# EAGLE design Angra_v.1.0 (EAGLE 9.4.2)
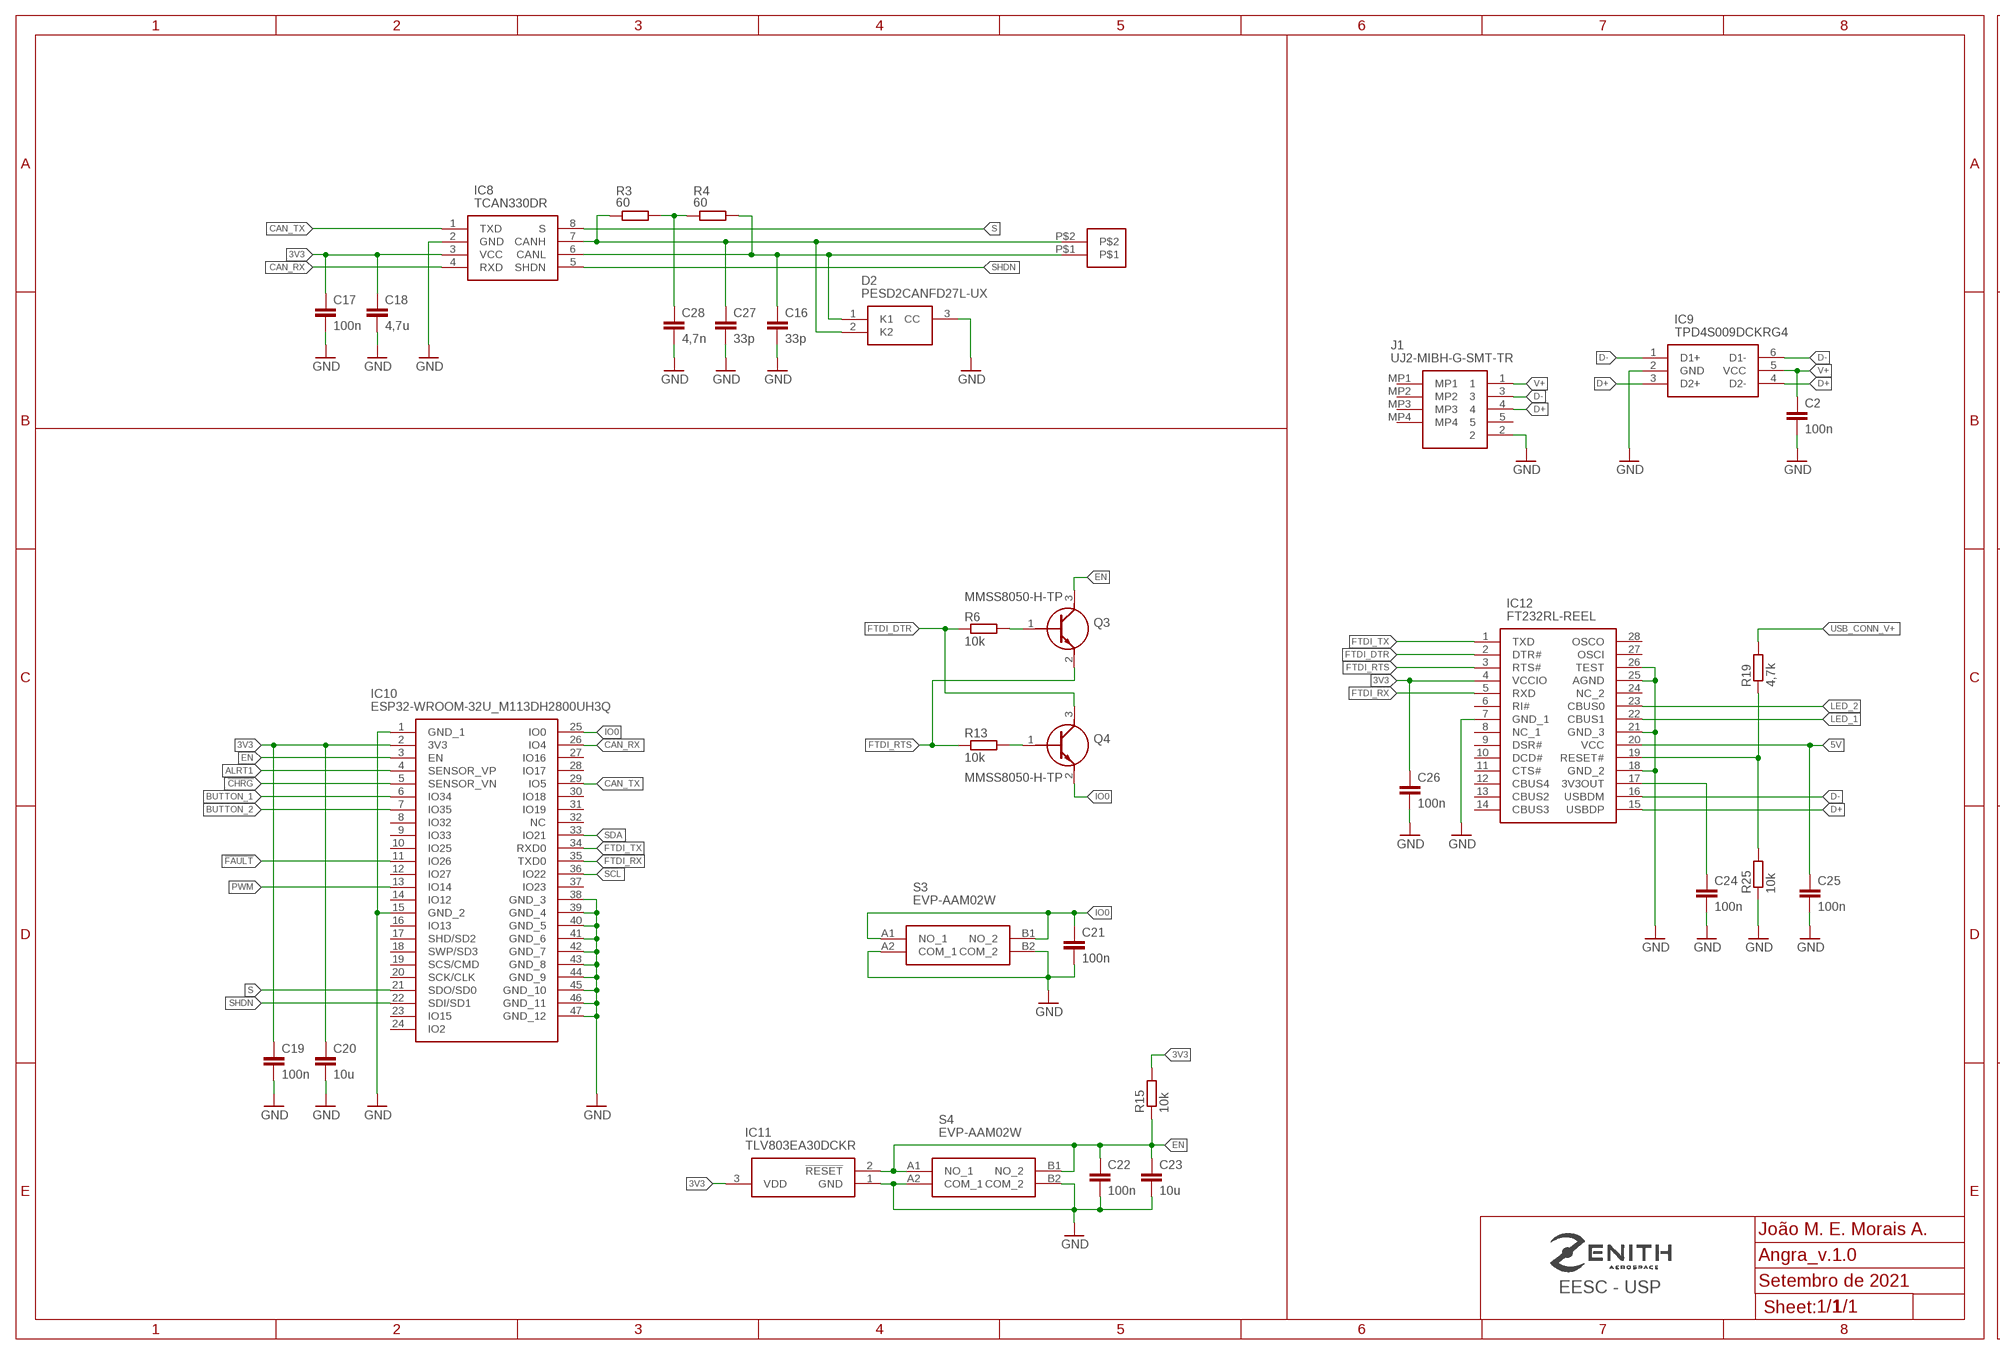
[diagram p0: schematic, sheet 1, part 1 of 2]
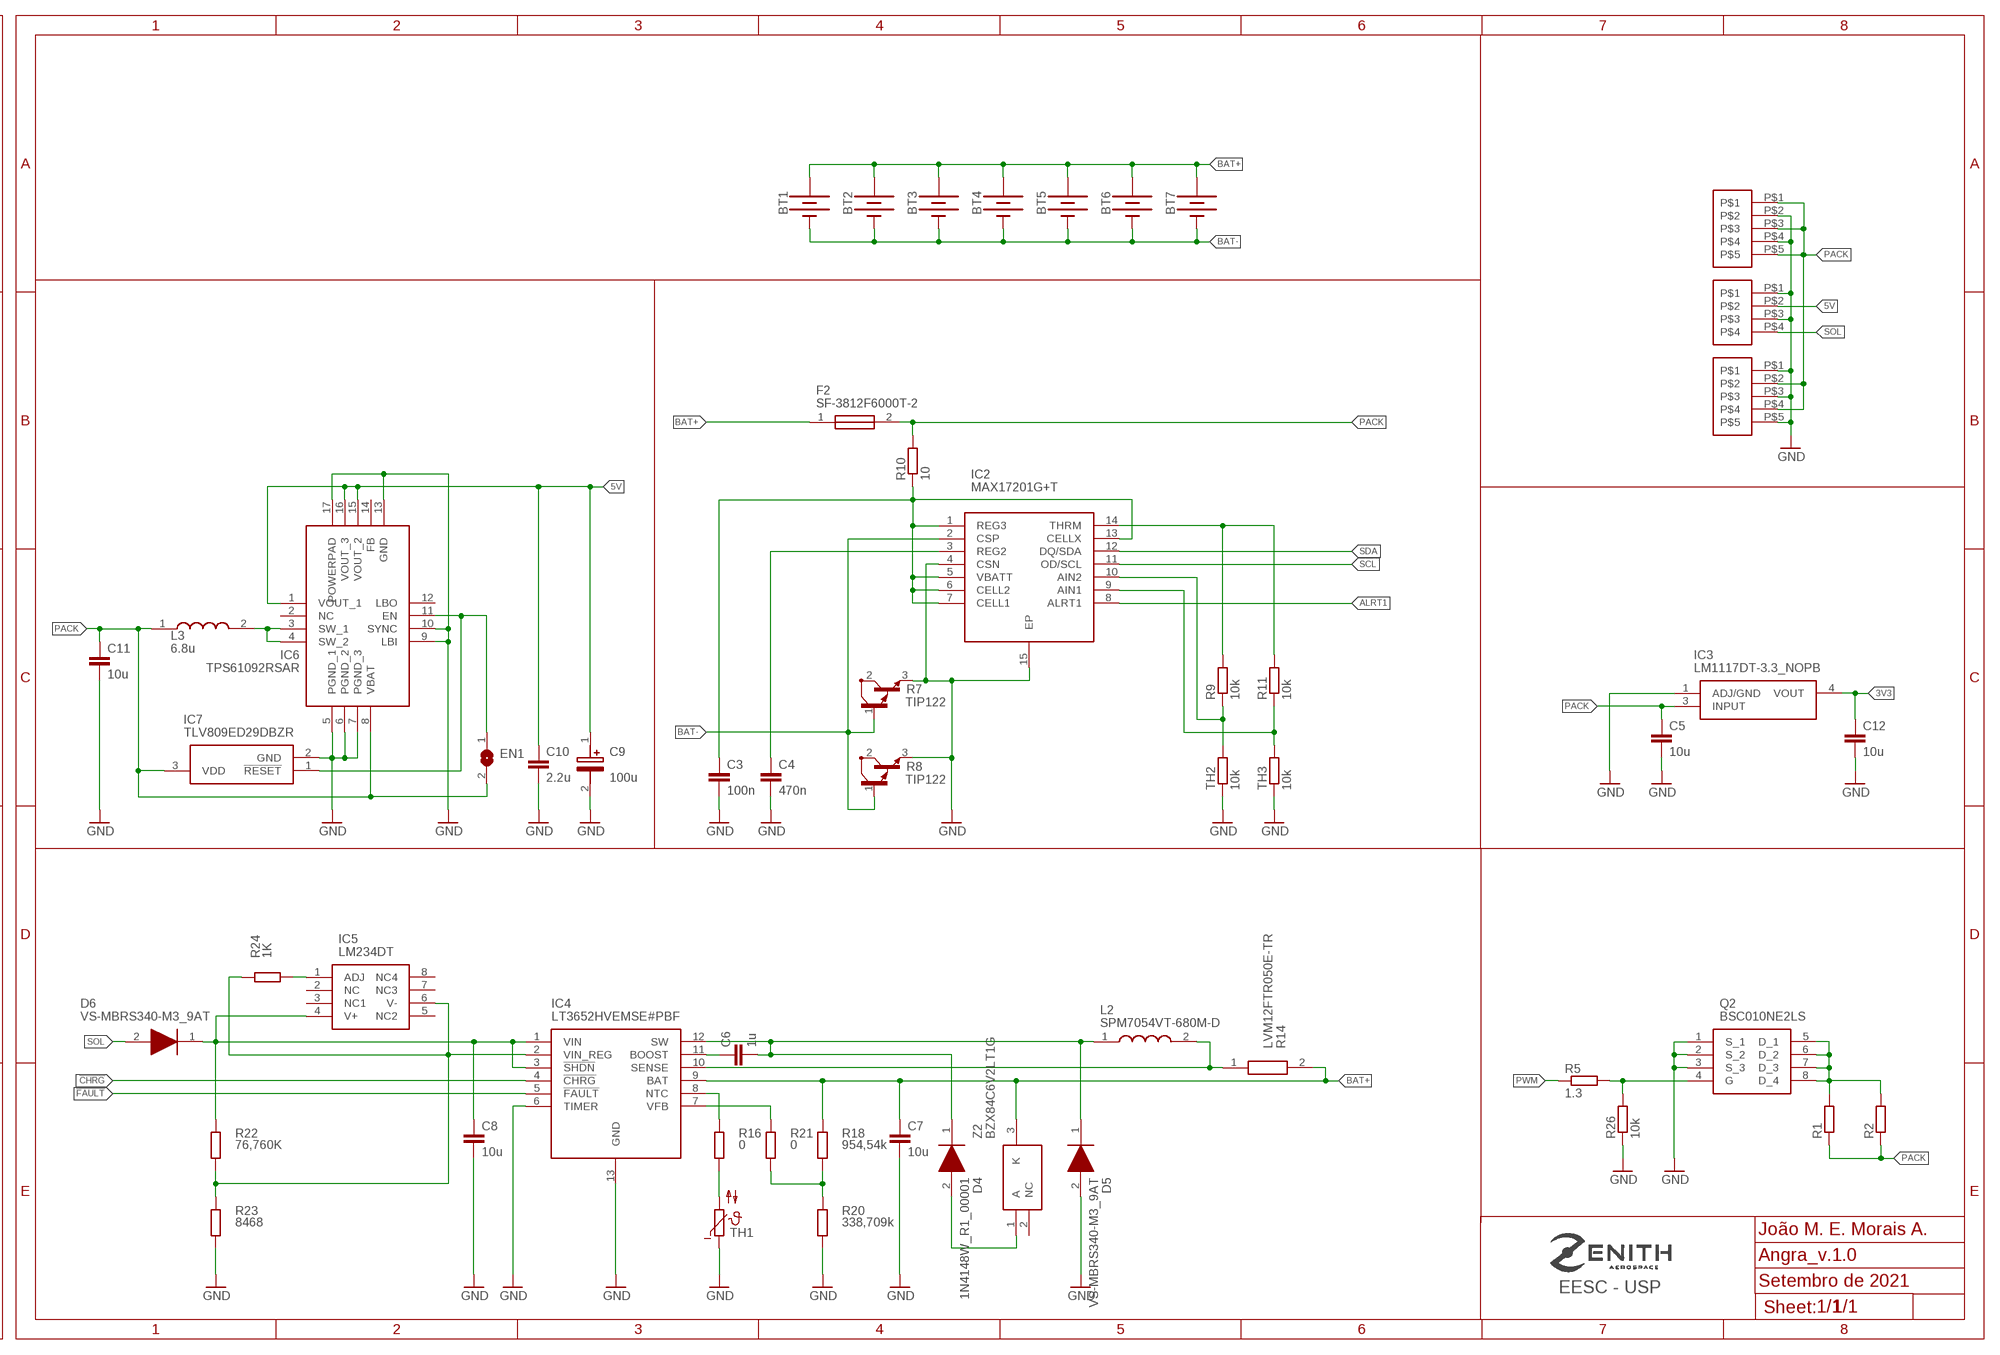
[diagram p1: schematic, sheet 1, part 2 of 2]

## Parts
BT1  BATTERY-18650  [BATTERY_18650-HOLDER]
BT2  BATTERY-18650  [BATTERY_18650-HOLDER]
BT3  BATTERY-18650  [BATTERY_18650-HOLDER]
BT4  BATTERY-18650  [BATTERY_18650-HOLDER]
BT5  BATTERY-18650  [BATTERY_18650-HOLDER]
BT6  BATTERY-18650  [BATTERY_18650-HOLDER]
BT7  BATTERY-18650  [BATTERY_18650-HOLDER]
C2  100n  C-EUC0805  [C0805]
C3  100n  C-EUC0805  [C0805]
C4  470n  C-EUC0805  [C0805]
C5  10u  C-EUC0805  [C0805]
C6  1u  C-EUC0805  [C0805]
C7  10u  C-EUC0805  [C0805]
C8  10u  C-EUC0805  [C0805]
C9  100u  T598B107M004ATE045  [CAPPM3528X210N]
C10  2.2u  C-EUC1206  [C1206]
C11  10u  C-EUC1206  [C1206]
C12  10u  C-EUC0805  [C0805]
C16  33p  C-EUC0805  [C0805]
C17  100n  C-EUC0805  [C0805]
C18  4,7u  C-EUC0805  [C0805]
C19  100n  C-EUC0805  [C0805]
C20  10u  C-EUC0805  [C0805]
C21  100n  C-EUC0805  [C0805]
C22  100n  C-EUC0805  [C0805]
C23  10u  C-EUC0805  [C0805]
C24  100n  C-EUC0805  [C0805]
C25  100n  C-EUC0805  [C0805]
C26  100n  C-EUC0805  [C0805]
C27  33p  C-EUC0805  [C0805]
C28  4,7n  C-EUC0805  [C0805]
D2  PESD2CANFD27L-UX  [SOT65P210X110-3N]
D4  1N4148W_R1_00001  [SOD3816X135N]
D5  VS-MBRS340-M3_9AT  [DIOM7959X262N]
D6  VS-MBRS340-M3_9AT  [DIOM7959X262N]
EN1  SOLDERJUMPERREFLOW_NOPASTE  [SOLDERJUMPER_REFLOW_NOPASTE]
F2  SF-3812F6000T-2  [FUSC10131X330N]
IC2  MAX17201G+T  [SON40P300X300X80-15N]
IC3  LM1117DT-3.3_NOPB  [TO228P991X238-3N]
IC4  LT3652HVEMSE#PBF  [SOP65P490X110-13N]
IC5  LM234DT  [SOIC127P600X175-8N@1]
IC6  TPS61092RSAR  [QFN65P400X400X100-17N]
IC7  TLV809ED29DBZR  [SOT95P237X112-3N]
IC8  TCAN330DR  [SOIC127P600X175-8N]
IC9  TPD4S009DCKRG4  [SOT65P210X110-6N]
IC10  ESP32-WROOM-32U_M113DH2800UH3Q  [ESP32WROOM32UM113DH2800UH3Q0]
IC11  TLV803EA30DCKR  [SOT65P210X110-3N@1]
IC12  FT232RL-REEL  [SOP65P778X200-28N]
J1  UJ2-MIBH-G-SMT-TR  [UJ2MIBHGSMTTR]
L2  SPM7054VT-680M-D  [SPM7054VT]
L3  6.8u  TYA40206R8M-10  [INDPM4040X210N]
Q2  BSC010NE2LS  [PG-TDSON-8]
Q3  MMSS8050-H-TP  [SI2305TP]
Q4  MMSS8050-H-TP  [SI2305TP]
R1  R-EU_0207/7  [0207/7]
R2  R-EU_0207/7  [0207/7]
R3  60  R-EU_R0805  [R0805]
R4  60  R-EU_R0805  [R0805]
R5  1.3  R-EU_R0805  [R0805]
R6  10k  R-EU_R0805  [R0805]
R7  TIP122  [TO220]
R8  TIP122  [TO220]
R9  10k  R-EU_R0805  [R0805]
R10  10  R-EU_R0805  [R0805]
R11  10k  R-EU_R0805  [R0805]
R13  10k  R-EU_R0805  [R0805]
R14  LVM12FTR050E-TR  [RESC3016X70N]
R15  10k  R-EU_R0805  [R0805]
R16  0  R-EU_R0805  [R0805]
R18  954,54k  R-EU_R0805  [R0805]
R19  4,7k  R-EU_R0805  [R0805]
R20  338,709k  R-EU_R0805  [R0805]
R21  0  R-EU_R0805  [R0805]
R22  76,760K  R-EU_R0805  [R0805]
R23  8468  R-EU_R0805  [R0805]
R24  1K  R-EU_R0805  [R0805]
R25  10k  R-EU_R0805  [R0805]
R26  10k  R-EU_R0805  [R0805]
S3  EVP-AAM02W  [EVPAAM02W]
S4  EVP-AAM02W  [EVPAAM02W]
TH1  NTC640  [P640]
TH2  10k  R-EU_0207/7  [0207/7]
TH3  10k  R-EU_0207/7  [0207/7]
U$1  S02B-XASS-1  [S02B-XASS-1]
U$2  S05B-XASS-1  [S05B-XASS-1]
U$3  S05B-XASS-1  [S05B-XASS-1]
U$4  S04B-XASS-1  [S04B-XASS-1]
Z2  BZX84C6V2LT1G  [SOT96P237X111-3N]

## Nets
3V3: C12.1 C17.1 C18.1 C19.1 C20.1 C26.1 IC3.4(VOUT) IC8.3(VCC) IC10.2(3V3) IC11.3(VDD) IC12.4(VCCIO) R15.2
5V: C9.1(+) C10.1 C25.1 IC6.1(VOUT_1) IC6.15(VOUT_2) IC6.16(VOUT_3) IC12.20(VCC) U$4.P$2
!CHRG: IC4.4(!CHRG) IC10.5(SENSOR_VN)
!FAULT: IC4.5(!FAULT) IC10.11(IO26)
ALRT1: IC2.8(ALRT1) IC10.4(SENSOR_VP)
BAT+: BT1.PWR@1(+) BT2.PWR@1(+) BT3.PWR@1(+) BT4.PWR@1(+) BT5.PWR@1(+) BT6.PWR@1(+) BT7.PWR@1(+) C7.1 F2.1 IC4.9(BAT) R14.2 R18.1 Z2.3(K)
BAT-: BT1.GND@1(-) BT2.GND@1(-) BT3.GND@1(-) BT4.GND@1(-) BT5.GND@1(-) BT6.GND@1(-) BT7.GND@1(-) IC2.2(CSP) R7.1(B) R8.1(B)
BUTTON_1: IC10.6(IO34)
BUTTON_2: IC10.7(IO35)
CAN_RX: IC8.4(RXD) IC10.26(IO4)
CAN_TX: IC8.1(TXD) IC10.29(IO5)
CANH: C27.1 D2.2(K2) IC8.7(CANH) R3.2 U$1.P$2
CANL: C16.1 D2.1(K1) IC8.6(CANL) R4.1 U$1.P$1
D+: IC9.3(D2+) IC9.4(D2-) IC12.15(USBDP) J1.4
D-: IC9.1(D1+) IC9.6(D1-) IC12.16(USBDM) J1.3
EN: C22.1 C23.1 IC10.3(EN) IC11.2(!RESET) Q3.3(C) R15.1 S4.A1(NO_1) S4.B1(NO_2)
FTDI_DTR: IC12.2(DTR#) Q4.3(C) R6.1
FTDI_RTS: IC12.3(RTS#) Q3.2(E) R13.1
FTDI_RX: IC10.35(TXD0) IC12.5(RXD)
FTDI_TX: IC10.34(RXD0) IC12.1(TXD)
GND: C2.2 C3.2 C4.2 C5.2 C7.2 C8.2 C9.2(-) C10.2 C11.2 C12.2 C16.2 C17.2 C18.2 C19.2 C20.2 C21.2 C22.2 C23.2 C24.2 C25.2 C26.2 C27.2 C28.2 D2.3(CC) D5.2(A) IC2.4(CSN) IC2.15(EP) IC3.1(ADJ/GND) IC4.6(TIMER) IC4.13(GND) IC6.5(PGND_1) IC6.6(PGND_2) IC6.7(PGND_3) IC6.9(LBI) IC6.10(SYNC) IC6.13(GND) IC6.17(POWERPAD) IC7.2(GND) IC8.2(GND) IC9.2(GND) IC10.1(GND_1) IC10.15(GND_2) IC10.38(GND_3) IC10.39(GND_4) IC10.40(GND_5) IC10.41(GND_6) IC10.42(GND_7) IC10.43(GND_8) IC10.44(GND_9) IC10.45(GND_10) IC10.46(GND_11) IC10.47(GND_12) IC11.1(GND) IC12.7(GND_1) IC12.18(GND_2) IC12.21(GND_3) IC12.25(AGND) IC12.26(TEST) J1.2 Q2.1(S_1) Q2.2(S_2) Q2.3(S_3) R7.3(E) R8.3(E) R20.2 R23.2 R25.1 R26.1 S3.A2(COM_1) S3.B2(COM_2) S4.A2(COM_1) S4.B2(COM_2) TH1.1 TH2.1 TH3.1 U$2.P$2 U$2.P$4 U$3.P$1 U$3.P$3 U$3.P$5 U$4.P$1 U$4.P$3
IO0: C21.1 IC10.25(IO0) Q4.2(E) S3.A1(NO_1) S3.B1(NO_2)
LED_1: IC12.22(CBUS1)
LED_2: IC12.23(CBUS0)
N$1: C28.1 R3.1 R4.2
N$2: IC6.3(SW_1) IC6.4(SW_2) L3.2
N$4: EN1.1 IC6.11(EN) IC7.1(!RESET)
N$5: Q2.4(G) R5.2 R26.2
N$7: Q4.1(B) R13.2
N$8: Q3.1(B) R6.2
N$9: C3.1 IC2.1(REG3) IC2.5(VBATT) IC2.6(CELL2) IC2.7(CELL1) IC2.13(CELLX) R10.1
N$10: C4.1 IC2.3(REG2)
N$11: IC2.14(THRM) R9.2 R11.2
N$12: IC2.10(AIN2) R9.1 TH2.2
N$13: IC2.9(AIN1) R11.1 TH3.2
N$15: IC12.19(RESET#) R19.1 R25.2
N$16: C24.1 IC12.17(3V3OUT)
N$18: IC4.10(SENSE) L2.2 R14.1
N$19: IC4.8(NTC) R16.1
N$20: R16.2 TH1.2
N$21: C6.2 D4.1(K) D5.1(K) IC4.12(SW) L2.1
N$22: IC4.7(VFB) R21.1
N$23: R18.2 R20.1 R21.2
N$24: C6.1 IC4.11(BOOST)
N$25: C8.1 D6.1(K) IC4.1(VIN) IC4.3(!SHDN) IC5.4(V+) R22.1
N$26: IC4.2(VIN_REG) IC5.6(V-) R22.2 R23.1 R24.1
N$27: IC5.1(ADJ) R24.2
N$28: D4.2(A) Z2.1(A)
PACK: C5.1 C11.1 EN1.2 F2.2 IC3.3(INPUT) IC6.8(VBAT) IC7.3(VDD) L3.1 R1.1 R2.1 R10.2 U$2.P$1 U$2.P$3 U$2.P$5 U$3.P$2 U$3.P$4
PWM: IC10.13(IO14) R5.1
RL: Q2.5(D_1) Q2.6(D_2) Q2.7(D_3) Q2.8(D_4) R1.2 R2.2
S: IC8.8(S) IC10.21(SDO/SD0)
SCL: IC2.11(OD/SCL) IC10.36(IO22)
SDA: IC2.12(DQ/SDA) IC10.33(IO21)
SHDN: IC8.5(SHDN) IC10.22(SDI/SD1)
SOL: D6.2(A) U$4.P$4
USB_CONN_V+: R19.2
V+: C2.1 IC9.5(VCC) J1.1
Unconnected: IC5.2(NC) IC5.3(NC1) IC5.5(NC2) IC5.7(NC3) IC5.8(NC4) IC6.2(NC) IC6.12(LBO) IC6.14(FB) IC10.8(IO32) IC10.9(IO33) IC10.10(IO25) IC10.12(IO27) IC10.14(IO12) IC10.16(IO13) IC10.17(SHD/SD2) IC10.18(SWP/SD3) IC10.19(SCS/CMD) IC10.20(SCK/CLK) IC10.23(IO15) IC10.24(IO2) IC10.27(IO16) IC10.28(IO17) IC10.30(IO18) IC10.31(IO19) IC10.32(NC) IC10.37(IO23) IC12.6(RI#) IC12.8(NC_1) IC12.9(DSR#) IC12.10(DCD#) IC12.11(CTS#) IC12.12(CBUS4) IC12.13(CBUS2) IC12.14(CBUS3) IC12.24(NC_2) IC12.27(OSCI) IC12.28(OSCO) J1.5 J1.MP1 J1.MP2 J1.MP3 J1.MP4 R7.2(C) R8.2(C) Z2.2(NC)

## Notes on the sheet
- João M. E. Morais A. | João M. E. Morais A.
- EESC - USP | Setembro de 2021 | EESC - USP | Setembro de 2021
- 1/1 | 1/1
- C:/Users/marcu/Desktop/Ensino Superior/Graduação - Eng Elétrica/Zenith/zenith-v2.bmp | C:/Users/marcu/Desktop/Ensino Superior/Graduação - Eng Elétrica/Zenith/zenith-v2.bmp

## Library data of the parts
BT1-BT7 = SparkFun-Batteries:BATTERY: Battery - Single Cell A variety of battery chemistries, sizes, and footprints. Device List: 20MM_PTH - Coin Cell Battery Holder - 20mm (PTH) <https://www.sparkfun.com/products/783> 6.8MM_PTH - Coin Cell Battery Holder - 6.8MM(SMD) <https://www.digikey.com/product-detail/en/seiko-instruments/MS621FE-FL11E/728-1057-ND/1889208?WT.srch=1&gclid=CNOQ5a6LzdQCFZS2wAodXCkE0g> 12MM_SMD - Coin Cell Battery Holder - 12mm (SMD) <https://www.sparkfun.com/products/10592> 12MM_PTH - Coin Cell Battery Holder - 12mm (PTH) <https://www.sparkfun.com/products/7948> 20MM_SMD - 20mm Coin Cell Battery Holder (SMD) (2 legs) Used on the Big Time Watch Kit <https://www.sparkfun.com/products/11734> 20MM_SMD_4LEGS - Coin Cell Battery Holder - 20mm (SMD) <https://www.sparkfun.com/products/11892> 20MM_SMD_4LEGS_OVERPASTE - Coin Cell Battery Holder - 20mm (SMD) <https://www.sparkfun.com/products/11892> (Over-paste on the legs) 24.5MM_PTH - Coin Cell Battery Holder - 24.5mm (PTH) <https://www.sparkfun.com/products/8863> 9V - 9V Battery Holder - PC Mount Used on the SparkFun SparkPunk Sound Kit <https://www.sparkfun.com/products/11177> and SparkFun SparkPunk Sequencer Kit <https://www.sparkfun.com/products/12707> 18650 - Battery Holder - 18650 (PTH) <https://www.sparkfun.com/products/13113> AA - Battery Holder - 1xAA (PTH) <https://www.sparkfun.com/products/7949> AAA - Battery Holder - 1xAAA (PTH) <https://www.sparkfun.com/products/12718> AA_KIT - Battery Holder - 1xAA (PTH) <https://www.sparkfun.com/products/7949> Special kit package - pads only have exposed copper on one side of the board. AAA_KIT - Battery Holder - 1xAAA (PTH) <https://www.sparkfun.com/products/12718> Special kit package - pads only have exposed copper on one side of the board.; PROD_ID: BATT-12327; SF_SKU: PRT-13113
C2-C8 C10-C12 C16-C28 = rcl:C-EU: CAPACITOR, European symbol; SPICEPREFIX: C
C9 = SamacSys_Parts:T598B107M004ATE045: Tantalum Capacitors - Polymer 4V 100uF 1380 20% ESR=45mOhms AEC-Q200 Source: Datasheet <https://api.kemet.com/component-edge/download/datasheet/T598B107M004ATE045.pdf>; DESCRIPTION: Tantalum Capacitors - Polymer 4V 100uF 1380 20% ESR=45mOhms AEC-Q200; HEIGHT: 2.1mm; MANUFACTURER_NAME: Kemet; MANUFACTURER_PART_NUMBER: T598B107M004ATE045; MOUSER_PART_NUMBER: 80-T598B107M004ATE45; MOUSER_PRICE-STOCK: https://www.mouser.co.uk/ProductDetail/KEMET/T598B107M004ATE045?qs=W%2FMpXkg%252BdQ7FMsv0Udyk9g%3D%3D
D2 = SamacSys_Parts:PESD2CANFD27L-UX: PESD2CANFD27L-U - ESD protection for In-vehicle networks Source: Datasheet <https://assets.nexperia.com/documents/data-sheet/PESD2CANFD27L-U.pdf>; DESCRIPTION: PESD2CANFD27L-U - ESD protection for In-vehicle networks; HEIGHT: 1.1mm; MANUFACTURER_NAME: Nexperia; MANUFACTURER_PART_NUMBER: PESD2CANFD27L-UX; MOUSER_PART_NUMBER: 771-PESD2CANFD27L-UX; MOUSER_PRICE-STOCK: https://www.mouser.co.uk/ProductDetail/Nexperia/PESD2CANFD27L-UX?qs=sPbYRqrBIVkgjetV%2FANAFQ%3D%3D
D4 = SamacSys_Parts:1N4148W_R1_00001: Diodes - General Purpose, Power, Switching /A2/TR/7"/HF/3K/SOD-123/SWI/SOD/USM-04/USM04-QI01/PJ/// Source: Datasheet; DESCRIPTION: Diodes - General Purpose, Power, Switching /A2/TR/7"/HF/3K/SOD-123/SWI/SOD/USM-04/USM04-QI01/PJ///; HEIGHT: 1.35mm; MANUFACTURER_NAME: PANJIT; MANUFACTURER_PART_NUMBER: 1N4148W_R1_00001; MOUSER_PART_NUMBER: 241-1N4148W_R1_00001; MOUSER_PRICE-STOCK: https://www.mouser.co.uk/ProductDetail/Panjit/1N4148W_R1_00001?qs=sPbYRqrBIVnqVztCqPNVrw%3D%3D
D5 D6 = SamacSys_Parts:VS-MBRS340-M3_9AT: Schottky Diodes & Rectifiers 3A 40V Single Die Schottky Rectifier Source: Datasheet <https://componentsearchengine.com/Datasheets/1/VS-MBRS340-M3_9AT.pdf>; DESCRIPTION: Schottky Diodes & Rectifiers 3A 40V Single Die Schottky Rectifier; HEIGHT: 2.62mm; MANUFACTURER_NAME: Vishay; MANUFACTURER_PART_NUMBER: VS-MBRS340-M3/9AT; MOUSER_PART_NUMBER: 78-VS-MBRS340-M39AT; MOUSER_PRICE-STOCK: https://www.mouser.co.uk/ProductDetail/Vishay-Semiconductors/VS-MBRS340-M3-9AT?qs=nc3S1USEIbv1XISTKnRMKw%3D%3D
EN1 = microbuilder:SOLDERJUMPER: SMD Solder JUMPER Solder the two pads together to create a connection, or remove the solder to break it. REFLOW - Use this footprint for solder paste and reflow ovens. WAVE - Use this footprint for hand-soldering (larger pads). CLOSED - Has a trace between the two pads to ensure it is closed by default. The trace needs to be cut to disable the jumper, and can be closed again by creating a solder bridge between the two pads.
F2 = SamacSys_Parts:SF-3812F6000T-2: Surface Mount Fuses Singlfuse 3812 fast-acting 250V AC 60A Source: Datasheet <https://www.mouser.be/datasheet/2/54/bourns_03202019_SF-3812F-T_datasheet-1544862.pdf>; DESCRIPTION: Surface Mount Fuses Singlfuse 3812 fast-acting 250V AC 60A; HEIGHT: 3.3mm; MANUFACTURER_NAME: Bourns; MANUFACTURER_PART_NUMBER: SF-3812F6000T-2; MOUSER_PART_NUMBER: 652-SF-3812F6000T-2; MOUSER_PRICE-STOCK: https://www.mouser.co.uk/ProductDetail/Bourns/SF-3812F6000T-2?qs=Cb2nCFKsA8pox2FPb0XXlQ%3D%3D
IC2 = SamacSys_Parts:MAX17201G+T: IC BATT MONITOR 1CELL 14TDFN Source: Datasheet <https://datasheets.maximintegrated.com/en/ds/MAX17201-MAX17215.pdf>; DESCRIPTION: IC BATT MONITOR 1CELL 14TDFN; HEIGHT: 0.8mm; MANUFACTURER_NAME: Maxim Integrated; MANUFACTURER_PART_NUMBER: MAX17201G+T; MOUSER_PART_NUMBER: 700-MAX17201G+T; MOUSER_PRICE-STOCK: https://www.mouser.co.uk/ProductDetail/Maxim-Integrated/MAX17201G%2bT?qs=6Gr%2FA8Y8f6fpSbQH80s5tg%3D%3D
IC3 = SamacSys_Parts:LM1117DT-3.3_NOPB: Space saving 800-mA low-dropout linear regulator with internal current limit Source: Datasheet; DESCRIPTION: Space saving 800-mA low-dropout linear regulator with internal current limit; HEIGHT: 2.38mm; MANUFACTURER_NAME: Texas Instruments; MANUFACTURER_PART_NUMBER: LM1117DT-3.3/NOPB; MOUSER_PART_NUMBER: 926-LM1117DT-3.3NOPB; MOUSER_PRICE-STOCK: https://www.mouser.co.uk/ProductDetail/Texas-Instruments/LM1117DT-33-NOPB?qs=X1J7HmVL2ZHOT670myqy2w%3D%3D
IC4 = SamacSys_Parts:LT3652HVEMSE#PBF: Power Tracking 2A Battery Charger Linear Technology LT3652HVEMSE#PBF, Battery Charger Lithium-Ion, Lithium-Polymer, 12-Pin MSOP Source: Datasheet <https://componentsearchengine.com/Datasheets/2/LT3652HVEMSE#PBF.pdf>; DESCRIPTION: Power Tracking 2A Battery Charger Linear Technology LT3652HVEMSE#PBF, Battery Charger Lithium-Ion, Lithium-Polymer, 12-Pin MSOP; HEIGHT: 1.1mm; MANUFACTURER_NAME: Linear Technology; MANUFACTURER_PART_NUMBER: LT3652HVEMSE#PBF; MOUSER_PART_NUMBER: 584-LT3652HVEMSE#PBF; MOUSER_PRICE-STOCK: https://www.mouser.co.uk/ProductDetail/Analog-Devices-Linear-Technology/LT3652HVEMSEPBF?qs=hVkxg5c3xu%252Bv4Rj40QGufg%3D%3D
IC5 = SamacSys_Parts:LM234DT: LM234DT, Voltage Reference 8-Pin SO Source: Datasheet; DESCRIPTION: LM234DT, Voltage Reference 8-Pin SO; HEIGHT: 1.75mm; MANUFACTURER_NAME: STMicroelectronics; MANUFACTURER_PART_NUMBER: LM234DT; MOUSER_PART_NUMBER: 511-LM234D; MOUSER_PRICE-STOCK: https://www.mouser.co.uk/ProductDetail/STMicroelectronics/LM234DT?qs=RnzODY3cU8u4ZnW3y3uo%252Bg%3D%3D
IC6 = SamacSys_Parts:TPS61092RSAR: 5-V Output, 500-mA, 96% Efficient Boost Converter, 20uA, QFN-16 Source: Datasheet <http://www.ti.com/lit/gpn/tps61092>; DESCRIPTION: 5-V Output, 500-mA, 96% Efficient Boost Converter, 20uA, QFN-16; HEIGHT: 1mm; MANUFACTURER_NAME: Texas Instruments; MANUFACTURER_PART_NUMBER: TPS61092RSAR; MOUSER_PART_NUMBER: 595-TPS61092RSAR; MOUSER_PRICE-STOCK: https://www.mouser.co.uk/ProductDetail/Texas-Instruments/TPS61092RSAR/?qs=Gse6rAGbi78LSxoouReguA%3D%3D
IC7 = SamacSys_Parts:TLV809ED29DBZR: Supervisory Circuits Low-power voltage supervisor (reset IC) with active-low, push-pull output 3-SOT-23 -40 to 125 Source: Datasheet <https://www.ti.com/lit/ds/symlink/tlv809e.pdf?ts=1623232092527&ref_url=https%3A%2F%2Fwww.ti.com%2Fproduct%2FTLV809E%3FkeyMatch%3DTLV809EF30DBZR%26tisearch%3Dsearch-everything%26usecase%3DOPN>; DESCRIPTION: Supervisory Circuits Low-power voltage supervisor (reset IC) with active-low, push-pull output 3-SOT-23 -40 to 125; HEIGHT: 1.12mm; MANUFACTURER_NAME: Texas Instruments; MANUFACTURER_PART_NUMBER: TLV809ED29DBZR; MOUSER_PART_NUMBER: 595-TLV809ED29DBZR; MOUSER_PRICE-STOCK: https://www.mouser.co.uk/ProductDetail/Texas-Instruments/TLV809ED29DBZR?qs=CiayqK2gdcJa0MXo3ZjyIg%3D%3D
IC8 = SamacSys_Parts:TCAN330DR: 3.3-V CAN Transceivers Source: Datasheet <http://www.ti.com/lit/gpn/TCAN330>; DESCRIPTION: 3.3-V CAN Transceivers; HEIGHT: 1.75mm; MANUFACTURER_NAME: Texas Instruments; MANUFACTURER_PART_NUMBER: TCAN330DR; MOUSER_PART_NUMBER: 595-TCAN330DR; MOUSER_PRICE-STOCK: https://www.mouser.co.uk/ProductDetail/Texas-Instruments/TCAN330DR?qs=9DwIlvx97afvSza3n7zoBw%3D%3D
IC9 = SamacSys_Parts:TPD4S009DCKRG4: ESD Suppressors / TVS Diodes 4 Ch Display/HDMI Port ESD Protection Source: Datasheet <https://www.ti.com/lit/ds/symlink/tpd4s009.pdf?HQS=TI-null-null-mousermode-df-pf-null-wwe&ts=1605773480012&ref_url=https%3A%2F%2Fwww.mouser.in%2F>; DESCRIPTION: ESD Suppressors / TVS Diodes 4 Ch Display/HDMI Port ESD Protection; HEIGHT: 1.1mm; MANUFACTURER_NAME: Texas Instruments; MANUFACTURER_PART_NUMBER: TPD4S009DCKRG4; MOUSER_PART_NUMBER: 595-TPD4S009DCKRG4; MOUSER_PRICE-STOCK: https://www.mouser.co.uk/ProductDetail/Texas-Instruments/TPD4S009DCKRG4/?qs=XGzIaZb%2FFYJF2wO%2FD%252BYU0w%3D%3D
IC10 = SamacSys_Parts:ESP32-WROOM-32U_M113DH2800UH3Q: WiFi Modules (802.11) SMD Module, ESP32-D0WD, 128Mbits SPI flash, UART mode, U.FL antenna connector Source: Datasheet <https://www.mouser.de/datasheet/2/891/esp32-wroom-32d_esp32-wroom-32u_datasheet_en-1365844.pdf>; DESCRIPTION: WiFi Modules (802.11) SMD Module, ESP32-D0WD, 128Mbits SPI flash, UART mode, U.FL antenna connector; HEIGHT: 3.3mm; MANUFACTURER_NAME: Espressif Systems; MANUFACTURER_PART_NUMBER: ESP32-WROOM-32U(M113DH2800UH3Q0); MOUSER_PART_NUMBER: 356-ES32WROOM32U16MB; MOUSER_PRICE-STOCK: https://www.mouser.co.uk/ProductDetail/Espressif-Systems/ESP32-WROOM-32UM113DH2800UH3Q0?qs=W%2FMpXkg%252BdQ5E9v8PGyRbpw%3D%3D
IC11 = SamacSys_Parts:TLV803EA30DCKR: Supervisory Circuits Low-power 3-pin voltage supervisor (reset IC) with active-low open-drain reset 3-SC70 -40 to 125 Source: Datasheet <https://www.ti.com/lit/ds/symlink/tlv803e.pdf?ts=1605772505370&ref_url=https%3A%2F%2Fwww.ti.com%2Fstore%2Fti%2Fen%2Fsearch%2F%3Ftext%3DTLV803EA29DCKR%26searchType%3D>; DESCRIPTION: Supervisory Circuits Low-power 3-pin voltage supervisor (reset IC) with active-low open-drain reset 3-SC70 -40 to 125; HEIGHT: 1.1mm; MANUFACTURER_NAME: Texas Instruments; MANUFACTURER_PART_NUMBER: TLV803EA30DCKR; MOUSER_PART_NUMBER: 595-TLV803EA30DCKR; MOUSER_PRICE-STOCK: https://www.mouser.co.uk/ProductDetail/Texas-Instruments/TLV803EA30DCKR?qs=vmHwEFxEFR9h1oD8%2F6nRXw%3D%3D
IC12 = SamacSys_Parts:FT232RL-REEL: USB/Serial IC UART SSOP-28 FTDI Chip FT232RL-REEL, USB Controller, 3MBd, USB 2.0, 1.8 5.25 V, 28-Pin SSOP Source: Datasheet <http://www.ftdichip.com/Support/Documents/DataSheets/ICs/DS_FT232R.pdf>; DESCRIPTION: USB/Serial IC UART SSOP-28 FTDI Chip FT232RL-REEL, USB Controller, 3MBd, USB 2.0, 1.8 5.25 V, 28-Pin SSOP; HEIGHT: 2mm; MANUFACTURER_NAME: FTDI Chip; MANUFACTURER_PART_NUMBER: FT232RL-REEL; MOUSER_PART_NUMBER: 895-FT232RL; MOUSER_PRICE-STOCK: https://www.mouser.co.uk/ProductDetail/FTDI/FT232RL-REEL?qs=D1%2FPMqvA103RC6OU6bKtoA%3D%3D
J1 = SamacSys_Parts:UJ2-MIBH-G-SMT-TR: USB Connectors Source: Datasheet; DESCRIPTION: USB Connectors; HEIGHT: 3.15mm; MANUFACTURER_NAME: CUI Inc.; MANUFACTURER_PART_NUMBER: UJ2-MIBH-G-SMT-TR; MOUSER_PART_NUMBER: 490-UJ2-MIBH-G-SMTTR; MOUSER_PRICE-STOCK: https://www.mouser.co.uk/ProductDetail/CUI-Devices/UJ2-MIBH-G-SMT-TR?qs=IS%252B4QmGtzzpvS1XQusp0iA%3D%3D
L2 = SamacSys_Parts:SPM7054VT-680M-D: Inductors for power circuits, Wound metal, Automotive Source: Datasheet <https://product.tdk.com/system/files/dam/doc/product/inductor/inductor/smd/catalog/inductor_automotive_power_spm7054vt-d_en.pdf>; DESCRIPTION: Inductors for power circuits, Wound metal, Automotive; HEIGHT: mm; MANUFACTURER_NAME: TDK; MANUFACTURER_PART_NUMBER: SPM7054VT-680M-D; MOUSER_PART_NUMBER: 810-SPM7054VT-680M-D; MOUSER_PRICE-STOCK: https://www.mouser.co.uk/ProductDetail/TDK/SPM7054VT-680M-D?qs=BJlw7L4Cy7%2F5GJUhXb8MnA%3D%3D
L3 = SamacSys_Parts:TYA40206R8M-10: PWRIND,SMT,SHLD,IRATED,4.00X4.00 Source: Datasheet <https://www.mouser.in/datasheet/2/987/Laird_Performance_TYA4020_series__Rev_A_-1877538.pdf>; DESCRIPTION: PWRIND,SMT,SHLD,IRATED,4.00X4.00; HEIGHT: 2.1mm; MANUFACTURER_NAME: Laird Performance Materials; MANUFACTURER_PART_NUMBER: TYA40206R8M-10; MOUSER_PART_NUMBER: 739-TYA40206R8M-10; MOUSER_PRICE-STOCK: https://www.mouser.co.uk/ProductDetail/Laird-Performance-Materials/TYA40206R8M-10?qs=sPbYRqrBIVmid25D4%2FyRGQ%3D%3D
Q2 = SamacSys_Parts:BSC010NE2LS: Infineon BSC010NE2LS N-channel MOSFET Transistor, 100 A, 25 V, 8-Pin TDSON Source: Datasheet <https://www.infineon.com/dgdl/Infineon-BSC010NE2LS-DS-v02_02-en.pdf?fileId=db3a304326dfb1300126fb3d176a3f1b>; DESCRIPTION: Infineon BSC010NE2LS N-channel MOSFET Transistor, 100 A, 25 V, 8-Pin TDSON; HEIGHT: mm; MANUFACTURER_NAME: Infineon; MANUFACTURER_PART_NUMBER: BSC010NE2LS; MOUSER_PART_NUMBER: 726-BSC010NE2LS; MOUSER_PRICE-STOCK: https://www.mouser.co.uk/ProductDetail/Infineon-Technologies/BSC010NE2LS?qs=HwMeRNENlMYcZAtWDSufww%3D%3D
Q3 Q4 = SamacSys_Parts:MMSS8050-H-TP: Bipolar Transistors - BJT 625mW, 25V, 1500mA Source: Datasheet <http://www.mccsemi.com/up_pdf/MMSS8050(SOT-23).pdf>; DESCRIPTION: Bipolar Transistors - BJT 625mW, 25V, 1500mA; HEIGHT: mm; MANUFACTURER_NAME: Micro Commercial Components (MCC); MANUFACTURER_PART_NUMBER: MMSS8050-H-TP; MOUSER_PART_NUMBER: 833-MMSS8050-H-TP; MOUSER_PRICE-STOCK: https://www.mouser.co.uk/ProductDetail/Micro-Commercial-Components-MCC/MMSS8050-H-TP?qs=FaVZESsvgndwiDXxXq5g0g%3D%3D
R1-R6 R9-R11 R13 R15 R16 R18-R26 TH2 TH3 = rcl:R-EU_: RESISTOR, European symbol; SPICEPREFIX: R
R7 R8 = transistor-neu-to92:TIP122: NPN BIPOLAR DARLINGTON TRANSISTOR
R14 = SamacSys_Parts:LVM12FTR050E-TR: Current Sense Resistors - SMD 0.5W 0.050 Ohm 1% Source: Datasheet <https://componentsearchengine.com/Datasheets/1/LVM12FTR050E-TR.pdf>; DESCRIPTION: Current Sense Resistors - SMD 0.5W 0.050 Ohm 1%; HEIGHT: 0.7mm; MANUFACTURER_NAME: Ohmite; MANUFACTURER_PART_NUMBER: LVM12FTR050E-TR; MOUSER_PART_NUMBER: 588-LVM12FTR050E-TR; MOUSER_PRICE-STOCK: https://www.mouser.co.uk/ProductDetail/Ohmite/LVM12FTR050E-TR?qs=sE1HjTVAc2ibWupmexfpPA%3D%3D
S3 S4 = SamacSys_Parts:EVP-AAM02W: SWITCH, LIGHT TOUCH, SMD, 3.5M Source: Datasheet <https://industrial.panasonic.com/cdbs/www-data/pdf/ATK0000/ATK0000C372.pdf>; DESCRIPTION: SWITCH, LIGHT TOUCH, SMD, 3.5M; HEIGHT: 1.9mm; MANUFACTURER_NAME: Panasonic; MANUFACTURER_PART_NUMBER: EVP-AAM02W; MOUSER_PART_NUMBER: 667-EVP-AAM02W; MOUSER_PRICE-STOCK: https://www.mouser.co.uk/ProductDetail/Panasonic/EVP-AAM02W?qs=OiaALIbqWFRm1%252BJyUPAzgA%3D%3D
TH1 = ptc-ntc:NTC640: PHILIPS NTC; OC_FARNELL: unknown; OC_NEWARK: unknown
U$1 = JST-XA:S02B-XASS-1
U$2 U$3 = JST-XA:S05B-XASS-1
U$4 = JST-XA:S04B-XASS-1
Z2 = SamacSys_Parts:BZX84C6V2LT1G: 250 mW, 6.2 V +/-5% ZenerDiodeVoltage Regulator Source: Datasheet <http://www.onsemi.com/pub/Collateral/BZX84C2V4LT1-D.PDF>; DESCRIPTION: 250 mW, 6.2 V +/-5% ZenerDiodeVoltage Regulator; HEIGHT: 1.11mm; MANUFACTURER_NAME: ON Semiconductor; MANUFACTURER_PART_NUMBER: BZX84C6V2LT1G; MOUSER_PART_NUMBER: 863-BZX84C6V2LT1G; MOUSER_PRICE-STOCK: https://www.mouser.co.uk/ProductDetail/ON-Semiconductor/BZX84C6V2LT1G?qs=vNc2DXHODiLlYtM0EF5Eqg%3D%3D

## Board
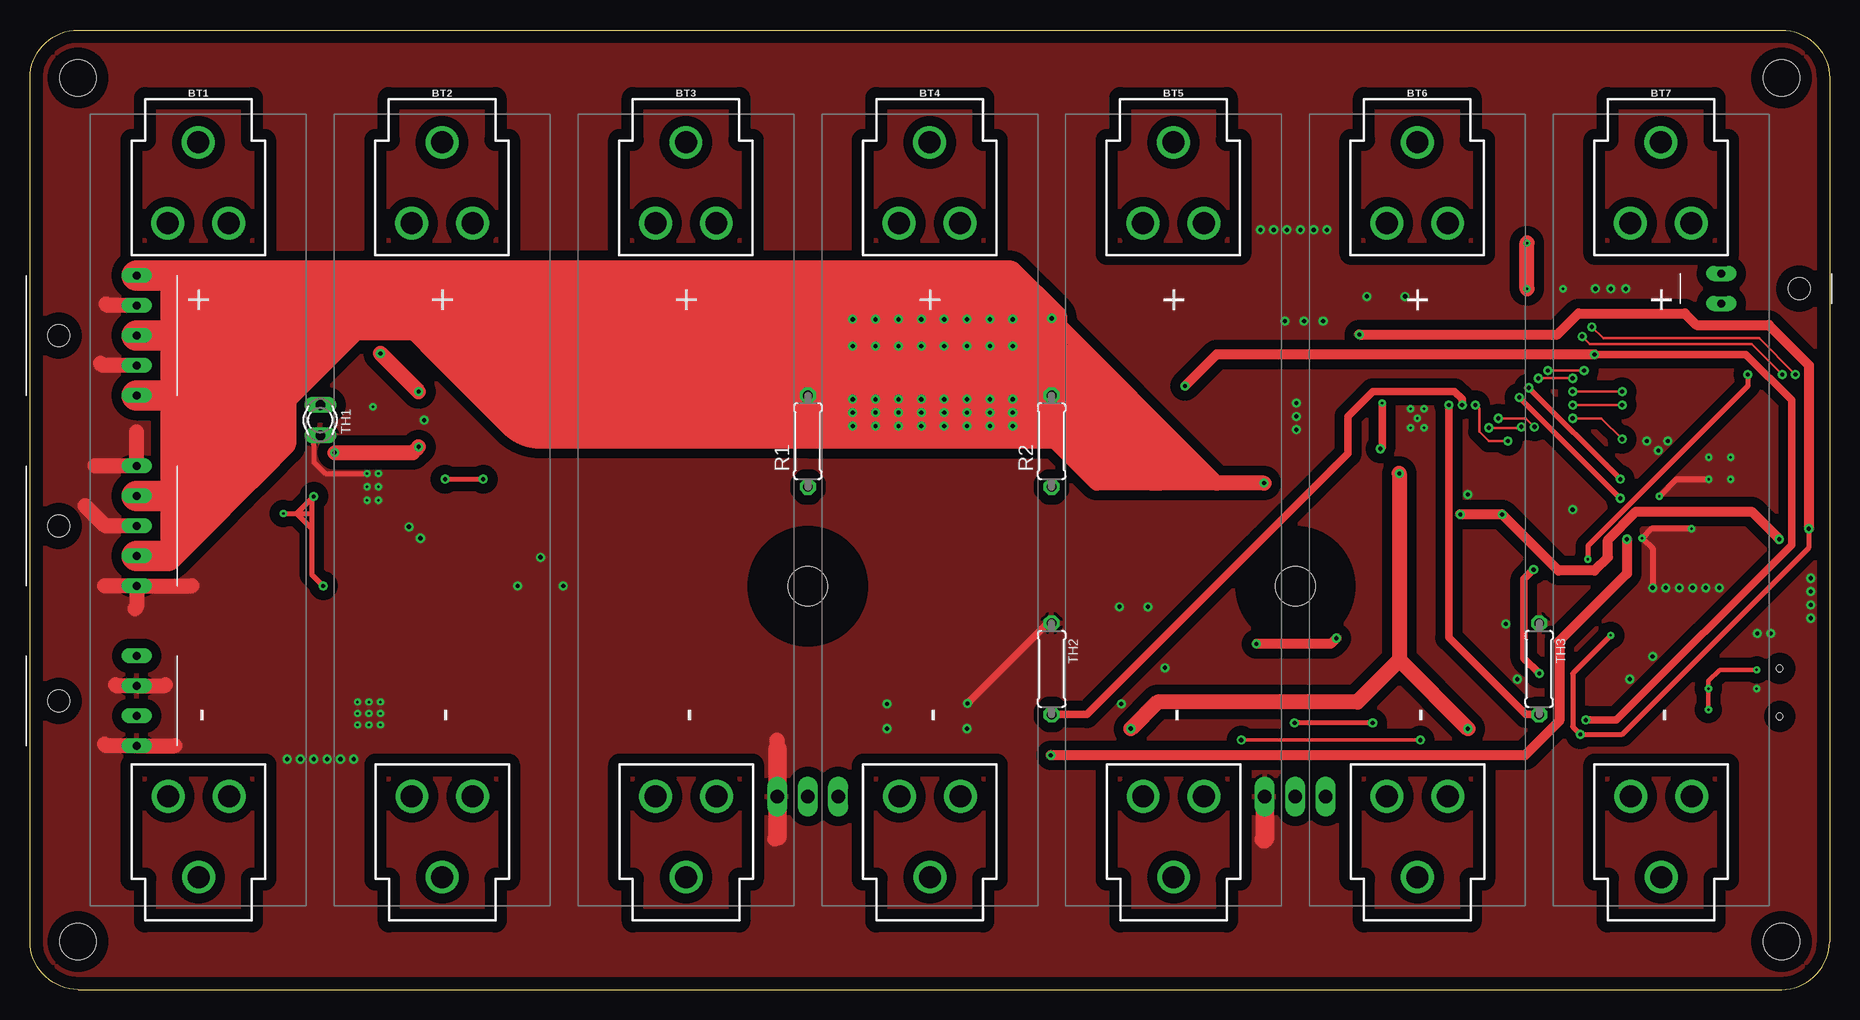
[diagram p2: board, top side]
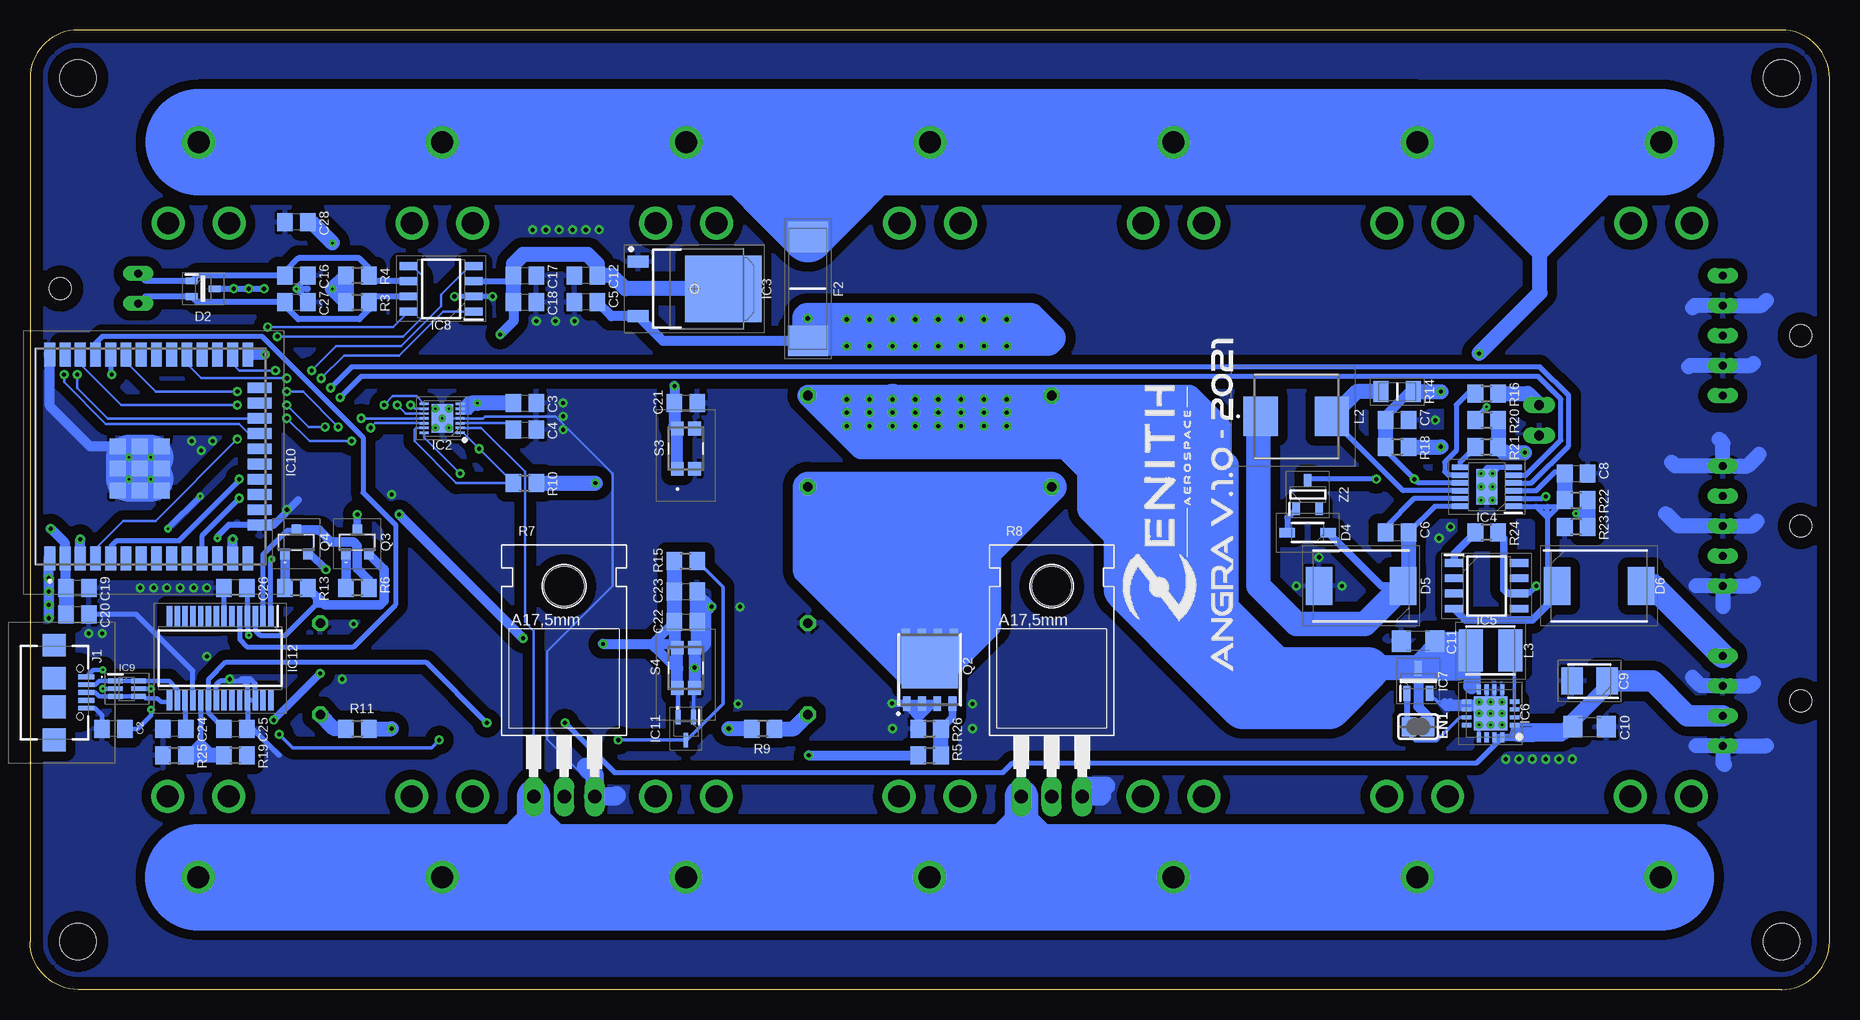
[diagram p3: board, bottom side, seen from below]

Size 150 x 80 mm. Coordinates in mm from the lower left corner, seen from the top.
Outline: 4,0 146,0 arc90 150,4 150,76 arc90 146,80 4,80 arc90 0,76 0,4 arc90 4,0
Copper layers (1*16): Top 0.035mm / dielectric 1.5mm / Bottom 0.035mm
Design rules "default": minimum track width 6mil, minimum drill 0.35mm, track to track 6mil, track to pad 6mil, pad to pad 6mil, via to via 6mil, smd to smd 6mil, copper to edge 40mil, drill to drill 6mil, minimum pad ring 10mil, minimum via ring 8mil, stop-mask expansion 4mil, vias tented up to drill 0mil, thermal gap 10mil
Holes 3 mm at 4,4 146,4 4,76 146,76

### Footprints (pad centres in the part's own frame; a part is rotated, then mirrored left to right if it is on the bottom)
BATTERY_18650-HOLDER = drill 1.829: GND@1 30.628,0.01; GND@2 23.88,2.55; GND@3 23.88,-2.53; PWR@1 -30.628,-0.01; PWR@2 -23.88,2.53; PWR@3 -23.88,-2.55
C0805 = smd 1.3 x 1.5: 1 -0.95,0; 2 0.95,0
CAPPM3528X210N = smd 1.8 x 2.25: 1 -1.45,0; 2 1.45,0
C1206 = smd 1.6 x 1.8: 1 -1.4,0; 2 1.4,0
SOT65P210X110-3N = smd 1 x 0.55: 1 -0.95,0.65; 2 -0.95,-0.65; 3 0.95,0
SOD3816X135N = smd 1.3 x 0.8: 1 -1.7,0; 2 1.7,0
DIOM7959X262N = smd 2.2 x 3.15: 1 -3.5,0; 2 3.5,0
SOLDERJUMPER_REFLOW_NOPASTE = smd 1.168 x 1.6: 1 -0.762,0; 2 0.762,0
FUSC10131X330N = smd 2.55 x 3.32: 1 -4.33,0; 2 4.33,0
SON40P300X300X80-15N = smd 0.75 x 0.2: 1 -1.5,1.2; 2 -1.5,0.8; 3 -1.5,0.4; 4 -1.5,0; 5 -1.5,-0.4; 6 -1.5,-0.8; 7 -1.5,-1.2; 8 1.5,-1.2; 9 1.5,-0.8; 10 1.5,-0.4; 11 1.5,0; 12 1.5,0.4; 13 1.5,0.8; 14 1.5,1.2 | smd 1.8 x 2.4: 15 0,0
TO228P991X238-3N = smd 1.75 x 1: 1 -4.7,2.285; 3 -4.7,-2.285 | smd 6.35 x 5.55: 4 2.4,0
SOP65P490X110-13N = smd 1.425 x 0.45: 1 -2.212,1.625; 2 -2.212,0.975; 3 -2.212,0.325; 4 -2.212,-0.325; 5 -2.212,-0.975; 6 -2.212,-1.625; 7 2.212,-1.625; 8 2.212,-0.975; 9 2.212,-0.325; 10 2.212,0.325; 11 2.212,0.975; 12 2.212,1.625 | smd 1.753 x 2.947: 13 0,0
SOIC127P600X175-8N@1 = smd 1.525 x 0.65: 1 -2.712,1.905; 2 -2.712,0.635; 3 -2.712,-0.635; 4 -2.712,-1.905; 5 2.712,-1.905; 6 2.712,-0.635; 7 2.712,0.635; 8 2.712,1.905
QFN65P400X400X100-17N = smd 0.8 x 0.35: 1 -2,0.975; 2 -2,0.325; 3 -2,-0.325; 4 -2,-0.975; 9 2,-0.975; 10 2,-0.325; 11 2,0.325; 12 2,0.975 | smd 0.35 x 0.8: 5 -0.975,-2; 6 -0.325,-2; 7 0.325,-2; 8 0.975,-2; 13 0.975,2; 14 0.325,2; 15 -0.325,2; 16 -0.975,2 | smd 2.8 x 2.8: 17 0,0
SOT95P237X112-3N = smd 1.25 x 0.6: 1 -1.05,0.95; 2 -1.05,-0.95; 3 1.05,0
SOIC127P600X175-8N = smd 1.528 x 0.65: 1 -2.711,1.905; 2 -2.711,0.635; 3 -2.711,-0.635; 4 -2.711,-1.905; 5 2.711,-1.905; 6 2.711,-0.635; 7 2.711,0.635; 8 2.711,1.905
SOT65P210X110-6N = smd 1.2 x 0.4: 1 -0.95,0.65; 2 -0.95,0; 3 -0.95,-0.65; 4 0.95,-0.65; 5 0.95,0; 6 0.95,0.65
ESP32WROOM32UM113DH2800UH3Q0 = smd 2 x 0.9: 1 -8.5,18.01; 2 -8.5,16.74; 3 -8.5,15.47; 4 -8.5,14.2; 5 -8.5,12.93; 6 -8.5,11.66; 7 -8.5,10.39; 8 -8.5,9.12; 9 -8.5,7.85; 10 -8.5,6.58; 11 -8.5,5.31; 12 -8.5,4.04; 13 -8.5,2.77; 14 -8.5,1.5; 25 8.5,1.5; 26 8.5,2.77; 27 8.5,4.04; 28 8.5,5.31; 29 8.5,6.58; 30 8.5,7.85; 31 8.5,9.12; 32 8.5,10.39; 33 8.5,11.66; 34 8.5,12.93; 35 8.5,14.2; 36 8.5,15.47; 37 8.5,16.74; 38 8.5,18.01 | smd 0.9 x 2: 15 -5.715,0.5; 16 -4.445,0.5; 17 -3.175,0.5; 18 -1.905,0.5; 19 -0.635,0.5; 20 0.635,0.5; 21 1.905,0.5; 22 3.175,0.5; 23 4.445,0.5; 24 5.715,0.5 | smd 1.33 x 1.33: 39 0.835,12.345; 40 -1,12.345; 41 -2.835,12.345; 42 0.835,10.51; 43 -1,10.51; 44 -2.835,10.51; 45 0.835,8.675; 46 -1,8.675; 47 -2.835,8.675
SOT65P210X110-3N@1 = smd 1.2 x 0.4: 1 -0.95,0.65; 2 -0.95,-0.65; 3 0.95,0
SOP65P778X200-28N = smd 1.7 x 0.45: 1 -3.5,4.225; 2 -3.5,3.575; 3 -3.5,2.925; 4 -3.5,2.275; 5 -3.5,1.625; 6 -3.5,0.975; 7 -3.5,0.325; 8 -3.5,-0.325; 9 -3.5,-0.975; 10 -3.5,-1.625; 11 -3.5,-2.275; 12 -3.5,-2.925; 13 -3.5,-3.575; 14 -3.5,-4.225; 15 3.5,-4.225; 16 3.5,-3.575; 17 3.5,-2.925; 18 3.5,-2.275; 19 3.5,-1.625; 20 3.5,-0.975; 21 3.5,-0.325; 22 3.5,0.325; 23 3.5,0.975; 24 3.5,1.625; 25 3.5,2.275; 26 3.5,2.925; 27 3.5,3.575; 28 3.5,4.225
UJ2MIBHGSMTTR = smd 0.4 x 1.35: 1 -1.3,2.64; 2 1.3,2.64; 3 -0.65,2.64; 4 0,2.64; 5 0.65,2.64 | smd 1.9 x 1.9: MP1 -3.95,-0.035; MP2 -1.2,-0.035; MP3 1.2,-0.035; MP4 3.95,-0.035 | hole 0.55: -2,2.115; 2,2.115
SPM7054VT = smd 2.85 x 3.3: 1 -2.975,0; 2 2.975,0
INDPM4040X210N = smd 2 x 3.5: 1 -1.65,0; 2 1.65,0
PG-TDSON-8 = smd 0.65 x 1.2: 1 -1.905,-6; 2 -0.635,-6; 3 0.635,-6; 4 1.905,-6 | smd 0.7 x 0.5: 5 2,0; 6 0.665,0; 7 -0.665,0; 8 -2,0 | smd 4.7 x 4.5: 9 0,-2.5
SI2305TP = smd 0.8 x 0.9: 1 -0.95,-1; 2 0.95,-1; 3 0,1
0207/7 = drill 0.813 octagon: 1 -3.81,0; 2 3.81,0
R0805 = smd 1.3 x 1.5: 1 -0.95,0; 2 0.95,0
TO220 = drill 1.118 long: 1 -2.54,-6.35; 2 0,-6.35; 3 2.54,-6.35 | hole 3.302: 0,11.176
RESC3016X70N = smd 1.25 x 1.75: 1 -1.35,0; 2 1.35,0
EVPAAM02W = smd 1.15 x 1.05: A1 -1.675,0.725; A2 -1.675,-0.725; B1 1.675,0.725; B2 1.675,-0.725
P640 = drill 0.813 long: 1 -1.27,0; 2 1.27,0
S02B-XASS-1 = drill 0.65 pad 1.27 long: P$1 0,0; P$2 2.5,0 | hole 1.8: 1.25,6.5
S05B-XASS-1 = drill 0.65 pad 1.27 long: P$1 0,0; P$2 2.5,0; P$3 5,0; P$4 7.5,0; P$5 10,0 | hole 1.8: 5,6.5
S04B-XASS-1 = drill 0.65 pad 1.27 long: P$1 0,0; P$2 2.5,0; P$3 5,0; P$4 7.5,0 | hole 1.8: 3.75,6.5
SOT96P237X111-3N = smd 1 x 0.6: 1 -1.2,0.955; 2 -1.2,-0.955; 3 1.2,0

### Placement (x,y rotation side)
BT1  14.04,40 270 top
BT2  34.36,40 270 top
BT3  54.68,40 270 top
BT4  75,40 270 top
BT5  95.32,40 270 top
BT6  115.64,40 270 top
BT7  135.96,40 270 top
C2  143.03,21.75 180 bottom
C3  108.74,48.9 0 bottom
C4  108.74,46.67 0 bottom
C5  103.66,57.31 180 bottom
C6  36.04,38.1 0 bottom
C7  36.04,47.47 0 bottom
C8  21.11,43.02 0 bottom
C9  20,25.72 180 bottom
C10  20,21.91 0 bottom
C11  34.29,29.05 180 bottom
C12  103.66,59.53 180 bottom
C16  127.79,59.53 0 bottom
C17  108.74,59.53 0 bottom
C18  108.74,57.31 0 bottom
C19  146.05,33.5 0 bottom
C20  146.05,31.27 0 bottom
C21  95.33,48.9 0 bottom
C22  95.33,30.64 0 bottom
C23  95.33,33.18 0 bottom
C24  137.95,21.75 180 bottom
C25  132.87,21.75 0 bottom
C26  132.87,33.5 180 bottom
C27  127.79,57.31 0 bottom
C28  127.79,63.98 180 bottom
D2  135.57,58.42 0 bottom
D4  43.5,38.1 180 bottom
D5  39.05,33.66 180 bottom
D6  19.21,33.66 0 bottom
EN1  34.29,21.91 0 bottom
F2  85.16,58.42 270 bottom
IC2  115.64,47.62 180 bottom
IC3  94.61,58.42 0 bottom
IC4  28.57,41.91 180 bottom
IC5  28.57,33.66 0 bottom
IC6  28.26,23.02 180 bottom
IC7  34.29,25.72 90 bottom
IC8  115.73,58.42 180 bottom
IC9  141.92,25.08 0 bottom
IC10  130.33,44.45 90 bottom
IC11  95.33,21.75 270 bottom
IC12  134.14,27.62 270 bottom
J1  147.96,24.77 270 bottom
L2  44.45,47.78 0 bottom
L3  28.26,28.26 0 bottom
Q2  75.01,29.84 0 bottom
Q3  122.71,37.31 0 bottom
Q4  127.79,37.31 0 bottom
R1  64.84,45.72 270 top
R2  85.16,45.72 270 top
R3  122.71,57.31 0 bottom
R4  122.71,59.53 180 bottom
R5  75.01,19.53 0 bottom
R6  122.71,33.5 180 bottom
R7  105.47,22.45 0 bottom
R8  64.83,22.45 0 bottom
R9  88.9,21.75 180 bottom
R10  108.74,42.23 0 bottom
R11  122.71,21.75 0 bottom
R13  127.79,33.5 180 bottom
R14  36.04,49.85 0 bottom
R15  95.33,35.72 0 bottom
R16  28.57,49.69 0 bottom
R18  36.04,45.24 0 bottom
R19  132.87,19.53 0 bottom
R20  28.57,47.47 180 bottom
R21  28.57,45.24 0 bottom
R22  21.11,40.8 0 bottom
R23  21.11,38.58 180 bottom
R24  28.57,38.1 180 bottom
R25  137.95,19.53 0 bottom
R26  75.01,21.75 0 bottom
S3  95.33,45.09 90 bottom
S4  95.33,26.83 90 bottom
TH1  24.2,47.47 90 top
TH2  85.16,26.73 270 top
TH3  125.8,26.73 270 top
U$1  140.97,59.69 270 top
U$2  8.89,49.53 90 top
U$3  8.89,33.66 90 top
U$4  8.89,20.32 90 top
Z2  43.5,41.27 90 bottom

### Tracks (layer width: path | path; a pad name or v marks a point on that pad's centre or on a via)
3V3  (via drill 0.2 pad 0.4, 0.35)
  Top 0.305: v100.97,20.8 v115.89,20.8 | v148.27,38.42 148.31,38.42
  Top 0.406: v131.76,29.53 128.59,26.35 128.59,21.91 v129.22,21.27 132.72,21.27 148.31,36.87 148.31,38.42
  Top 0.813: 148.31,38.42 148.31,52.03 144.94,55.4 138.91,55.4 137.95,56.36 129.06,56.36 127.32,54.61 v110.81,54.61
  Bottom 0.305: v100.97,20.8 v100.96,20.8 IC11.3 95.25,20.8 92.23,23.81 92.23,33.57 R15.2 | v115.89,20.8 116.52,20.16 128.11,20.16 v129.22,21.27
  Bottom 0.406: C26.1 131.87,33.44 IC12.4 131.87,29.63 v131.76,29.53
  Bottom 0.508: IC8.3 110.17,59.05 C17.1
  Bottom 0.61: 109.38,56.99 C18.1
  Bottom 0.813: C19.1 147.07,33.57 IC10.2 147.07,37.22 v148.27,38.42 | C18.1 109.69,55.72 v110.81,54.61
  Bottom 1.27: C19.1 C20.1 | C18.1 C17.1 109.69,60.49 108.9,61.28 103.5,61.28 102.71,60.49 C12.1 101.47,59.53 100.36,58.42 IC3.4
5V  (via drill 0.35)
  Top 0.406: v111.92,22.23 v105.41,22.23
  Bottom 0.305: 27.78,21.02 IC6.15 27.93,20.37 28.12,20.18 | C10.1 21.54,22.04 IC6.1 26.26,21.75 26.26,21.5 26.04,21.27
  Bottom 0.406: C25.1 135.12,23.04 IC12.20 135.12,25.85 133.67,27.3 117,27.3 v111.92,22.23 | v105.41,22.23 101.28,18.1 68.9,18.1 68.1,18.89 29.41,18.89 28.12,20.18 IC6.16
  Bottom 0.61: IC6.16 27.78,21.02 | IC6.16 26.29,21.02 26.04,21.27 | IC6.16 24.86,21.02 24.61,21.27 25.78,21.27 26.26,21.75
  Bottom 1.27: C9.1 18.55,25.25 21.4,22.4 C10.1 21.72,21.91 22.36,21.27 24.61,21.27 26.04,21.27
  Bottom 1.778: U$4.P$2 11.85,22.82 14.74,25.72 C9.1
!CHRG  (via drill 0.35)
  Top 0.406: v132.56,42.55 v124.94,50.16
  Bottom 0.406: IC4.4 24.84,42.23 21.75,45.32 21.75,49.53 24.13,51.91 123.19,51.91 v124.94,50.16 | IC10.5 143.26,36.92 142.76,37.42 137.56,37.42 132.56,42.42 v132.56,42.55
!FAULT  (via drill 0.35)
  Top 0.406: v124.14,49.37 v132.56,40.96
  Bottom 0.406: IC4.5 25.3,42.88 22.38,45.8 22.38,49.21 24.29,51.12 122.4,51.12 v124.14,49.37 | IC10.11 135.64,37.87 v132.56,40.96
ALRT1  (via drill 0.35)
  Top 0.191: v132.72,45.88 130.97,47.62 v128.59,47.62 | v120.49,48.74 120.81,48.42 120.81,46.51 121.6,45.72 v123.19,45.72
  Bottom 0.191: IC10.4 144.53,36.76 142.24,39.05 139.54,39.05 v132.72,45.88 | v128.59,47.62 126.68,45.72 v123.19,45.72 | IC2.8 117.78,49.46 119.77,49.46 v120.49,48.74
BAT+  (via drill 0.35)
  Top 0.406: v34.61,42.55 v37.78,42.55
  Top 1.27: v32.38,49.85 v29.21,53.02
  Bottom 0.406: R18.1 36.99,44.92 v34.61,42.55 34.3,42.23 IC4.9 | R14.2 35,49.85 | 36.99,47.87 C7.1 | v37.78,42.55 43.43,42.55 Z2.3
  Bottom 0.813: 36.99,47.87 35,49.85
  Bottom 1.27: R18.1 C7.1 | R14.2 v32.38,49.85 | v29.21,53.02 24.13,58.1 24.13,61.36 | 24.13,61.36 24.13,62.23 | 24.13,63.5 24.13,64.77 | 24.13,70.63 24.13,64.77 | 23.7,61.8 14.86,70.63 BT1.PWR@1 | 23.7,61.8 24.13,61.36 | 24.13,61.36 31.43,68.66 31.43,69.53 | 24.13,62.23 20.32,66.04 20.32,67.31 24.13,63.5 | 24.13,62.23 24.13,63.5 | 23.7,61.8 27.94,66.04 | 24.13,63.5 26.67,66.04 | 24.13,64.77 26.67,67.31 | 24.13,64.77 21.59,67.31
  Bottom 4.191: F2.1 85.16,71.05 85.09,71.12 85.09,70.63 | F2.1 77.28,70.63 BT4.PWR@1 | F2.1 93.04,70.63 BT5.PWR@1
  Bottom 8.89: BT7.PWR@1 BT6.PWR@1 BT5.PWR@1 85.09,70.63 BT4.PWR@1 BT3.PWR@1 BT2.PWR@1 BT1.PWR@1
BAT-
  Bottom 0.191: 108.74,8.89 108.82,8.81 108.9,8.73 108.9,9.05 108.58,9.37 | IC2.2 112.39,46.83 108.74,43.18 108.74,30.64 108.01,29.91 R7.1 | 102.71,10.25 102.71,9.37
  Bottom 0.406: 107.95,8.57 108.58,8.57 108.82,8.81
  Bottom 2.794: 108.01,14.13 R7.1 108.01,14.06 110.33,11.75 | 108.01,14.13 108.01,8.64 107.95,8.57 | 108.01,14.13 105.31,11.43 103.98,11.43 | 67.37,14.04 67.37,7.68 66.67,6.99 65.96,7.7 66.52,8.26 | R8.1 67.37,14.04 | 67.37,14.04 62.71,9.37 | BT4.GND@1 72.04,9.37 67.37,14.04
  Bottom 8.89: BT1.GND@1 BT2.GND@1 BT3.GND@1 62.71,9.37 BT4.GND@1 BT5.GND@1 102.71,9.37 108.58,9.37 BT6.GND@1 BT7.GND@1
CAN_RX  (via drill 0.35)
  Top 0.191: v126.52,51.59 v129.54,51.59
  Bottom 0.191: IC10.26 133.1,52.14 132.56,51.59 v129.54,51.59 | IC8.4 113.35,60.33 115.73,57.94 115.73,56.99 119.06,53.66 124.46,53.66 v126.52,51.59
CAN_TX  (via drill 0.35)
  Top 0.191: v125.73,50.96 v128.59,50.96
  Bottom 0.191: IC10.29 136.91,52.14 135.73,50.96 v128.59,50.96 | IC8.1 115.56,56.52 119.21,52.86 123.83,52.86 v125.73,50.96
CANH
  Bottom 0.508: IC8.7 121.29,57.78 R3.2 121.76,56.67 122.56,55.88 127.64,55.88 128.74,56.99 C27.1 136.06,57.31 D2.2 136.54,57.78 140.38,57.78 U$1.P$2
CANL
  Bottom 0.508: IC8.6 121.29,59.05 R4.1 121.76,60.17 122.56,60.96 127.64,60.96 128.74,59.85 C16.1 136.06,59.53 D2.1 140.35,59.07 U$1.P$1
D+
  Bottom 0.381: J1.4 144.56,24.77 144.23,24.43 IC9.3 IC9.4 140.5,24.43 140.34,24.27 139.38,24.27 139.07,23.96 138.53,23.96 IC12.15
  Bottom 0.406: IC12.15
D-
  Bottom 0.381: J1.3 144.55,25.41 144.23,25.73 IC9.1 IC9.6 138.41,25.73 137.72,25.04 IC12.16
EN  (via drill 0.35)
  Top 0.813: v145.81,37.54 143.51,39.85 133.87,39.85 131.52,37.5 131.52,36.04 130.41,34.92 127.4,34.92 v122.71,39.61 v119.22,39.61 | v108.9,29.29 108.43,28.81 v102.23,28.81
  Bottom 0.305: 96.05,26.67 96.05,26.83
  Bottom 0.381: IC11.2 95.98,25.08 S4.A1
  Bottom 0.61: Q3.3 v122.71,39.61
  Bottom 0.813: IC10.3 v145.8,37.54 v145.81,37.54 | v119.22,39.61 v108.9,29.29 | v102.23,28.81 98.11,28.81 | 98.11,28.81 96.36,28.81 S4.B1 | C22.1 98.11,28.81 | 97.95,28.97 97.95,28.56 96.05,26.67
  Bottom 1.016: S4.A1 96.05,26.67 | 96.05,26.83 S4.B1 96.28,28.73 C22.1
  Bottom 1.27: C22.1 C23.1 R15.1
FTDI_DTR
  Bottom 0.406: IC12.2 130.57,36.28 128.54,38.31 Q4.3
  Bottom 0.787: R6.1 121.76,34.13 122.71,35.08 122.71,36.99 123.03,37.31 124.89,37.31 125.89,38.31 Q4.3
FTDI_RTS
  Bottom 0.406: IC12.3 131.22,29.94 130.81,29.53 128.75,29.53 126.21,32.07 | 125.81,32.46 126.21,32.07 | 126.21,32.07 125.42,32.07 | 126.21,32.07 126.21,32.7 126.13,32.78
  Bottom 0.787: R13.1 126.13,32.78 125.81,32.46 125.42,32.07 120.81,32.07 120.49,32.38 120.49,35.03 Q3.2
FTDI_RX
  Bottom 0.406: IC12.5 132.52,29.17 131.92,28.57 123.03,28.57 119.54,32.07 119.54,38.73 122.24,41.43 122.24,46.04 130.65,54.45 143.99,54.45 144.53,53.9 IC10.35
FTDI_TX  (via drill 0.2 pad 0.4, 0.35)
  Top 0.406: v129.86,35.88 129.86,36.99 143.19,50.32 v143.19,51.28
  Bottom 0.406: IC12.1 129.92,35.82 v129.86,35.88 | IC10.34 143.26,51.35 v143.19,51.28
GND  (via drill 0.2 pad 0.4, 0.35)
  Top 0.406: v28.1,43.02 24.61,43.02 23.65,43.97 23.65,45.4 23.65,45.65 TH1.1
  Top 0.508: v135.25,33.5 135.25,36.75 v134.38,37.62 135.18,38.42 v138.51,38.42 | v135.81,41.12 137.24,42.55 v139.94,42.55
  Top 0.61: TH2.1 84.84,30.54 v78.14,23.84
  Top 1.27: 62.29,20 62.29,20.73 62.23,20.8 | 62.29,12.76 62.07,12.54 | 11.27,25.4 11.19,25.32 U$4.P$3 7.22,25.32 7.14,25.4 | 12.06,20.32 U$4.P$1 6.35,20.32 6.19,20.48 | U$2.P$4 6.47,57.03 6.35,57.15 | U$2.P$2 6.07,52.03 5.87,52.23 | 5.4,43.66 U$3.P$5 8.89,46.51 | U$3.P$3 6.27,38.66 4.6,40.32 | U$3.P$1 6.19,33.66 | U$3.P$1 13.49,33.66 | U$3.P$1 8.89,31.91 8.73,31.75
  Top 1.524: 62.29,20 R8.3 62.29,12.76 | R7.3 102.93,12.61 102.87,12.54
  Bottom 0.152: 115.41,47.62 IC2.15
  Bottom 0.191: R7.3 102.93,16.89 106.9,20.86 106.9,28.19 101.44,33.66 101.44,43.02 106.2,47.78 112.08,47.78 112.24,47.62 IC2.4 v115.65,47.62
  Bottom 0.305: IC6.13 29.23,22.04 IC6.17 | IC6.10 28.58,23.34 | IC6.9 29.23,23.99 29.05,23.81 | IC6.7 28.58,23.34 | 28.58,23.34 IC6.17 | IC6.6 27.93,23.34 IC6.17 | IC6.5 27.28,23.99 IC6.17 | IC11.1 94.68,25.08 S4.A2 | IC6.9 IC6.10 | IC6.9 31.59,23.99 32.07,23.99 32.67,23.99 IC7.2 32.02,23.34 IC6.10
  Bottom 0.381: IC9.2 v143.93,25.08 | J1.2 144.59,23.46 143.98,22.86 C2.2
  Bottom 0.406: IC8.2 114.3,57.78 | IC8.2 v114.62,57.78 | v111.44,57.78 IC8.2 | IC12.25 131.87,21.8 C25.2 131.44,21.75 129.22,19.53 | IC12.25 IC12.26 131.22,25.49 131.6,25.88 | v28.57,48.58 29.52,47.63 R20.2 | IC4.6 27.59,43.53 | 27.59,43.53 v28.1,43.02 | 27.59,43.53 28.54,43.53 v29.05,43.02 | IC12.21 134.47,25.39 134.14,25.72 133.51,25.72 | IC12.25 131.87,25.35 | 133.51,25.72 132.24,25.72 | 132.24,25.72 132.4,25.88 131.6,25.88 | 132.24,25.72 131.87,25.35 | 131.87,25.35 131.87,25.61 131.6,25.88 | IC12.7 C26.2 | IC12.18 136.42,26.56 141.13,31.27 C20.2 | v133.35,25.88 133.51,25.72
  Bottom 0.508: D2.3 v133.03,58.42 v131.76,58.42 v130.49,58.42 | v127.79,58.42 126.84,59.37 C16.2 | v127.79,58.42 126.84,57.47 C27.2 | v127.79,58.42 126.84,58.42 | IC10.15 133.43,38.73 134.38,37.78 v134.38,37.62 | v138.51,38.42 v135.81,41.12 135.73,41.12
  Bottom 0.61: Q2.2 Q2.3 74.69,23.84 75.96,22.58 R26.1 | Q2.2 Q2.1 | Q2.1 v78.14,23.84 | Q2.2 75.96,23.53 R26.1 | Q2.1 76.91,23.66 76.64,23.38 | 76.64,23.38 75.96,22.7 R26.1 | Q2.2 76.11,23.38 76.64,23.38 | v139.94,44.37 139.02,45.28 IC10.45 | IC10.15 129.7,38.73 127.64,40.8 | 32.07,23.99 31.89,23.81 31.41,23.81 31.59,23.99 | IC6.17 29.05,23.81 29.37,23.81
  Bottom 0.711: 31.41,23.81 29.37,23.81
  Bottom 0.813: v93.19,31.91 94.38,33.1 C23.2 | v93.19,31.91 94.38,30.72 C22.2 | v93.19,31.91 93.66,31.43 93.66,28.73 93.89,28.5 S4.B2 | IC10.39 144.98,45.28 148.34,48.65 IC10.38 | IC10.1 148.43,35.86 v148.43,34.29 v148.43,33.18 v148.43,32.07 v148.43,30.96
  Bottom 1.016: C22.2 94.38,28.73 S4.B2 S4.A2
  Bottom 1.27: C23.2 C22.2 | U$4.P$1 5.24,20.32 | U$4.P$1 11.11,20.32 | U$4.P$1 8.89,18.89 8.73,18.73 | 6.35,25.56 6.59,25.32 U$4.P$3 10.71,25.32 11.43,26.04 | U$3.P$1 6.51,33.66 6.35,33.81 | U$3.P$1 11.11,33.66 | U$3.P$1 8.89,31.91 | 13.65,39.69 12.62,38.66 U$3.P$3 6.43,38.66 6.03,39.05 | U$3.P$5 12.86,43.66 13.18,43.97 | U$3.P$5 6.83,43.66 5.87,44.61 | U$3.P$5 8.89,45.56 9.21,45.88 | 11.75,51.91 11.63,52.03 U$2.P$2 6.55,52.03 6.35,52.23 | 11.43,56.83 11.23,57.03 U$2.P$4 5.68,57.03 5.24,57.47
  Bottom 1.524: 103.66,18.57 102.93,17.84 R7.3 101.22,16.1 101.12,16.19 | 60.33,16.99 62.24,16.99 62.24,16.15 R8.3 60.74,16.1 60.64,16.19
  Bottom 3.81: v139.94,44.37 v141.76,44.37 v141.76,42.55 v139.94,42.55
  other vias: 28.26,23.02 27.3,23.02 27.3,23.97 28.26,23.97 29.21,23.97 29.21,23.02 29.21,22.07 28.26,22.07 27.3,22.07 29.05,41.91 29.05,40.8 28.1,41.91 28.1,40.8 102.55,63.34 103.66,63.34 104.78,63.34 105.89,63.34 107,63.34 108.11,63.34 104.62,55.72 106.2,55.72 107.79,55.72 105.57,48.9 105.57,46.67 105.57,47.78 94.61,26.83 90.81,31.91 90.96,23.81 78.11,21.75 71.44,21.75 71.44,23.81 21.43,19.21 22.54,19.21 23.65,19.21 24.77,19.21 25.88,19.21 26.99,19.21 31.59,38.58 32.54,37.62 32.86,47.47 140.81,33.5 115.09,48.42 116.2,48.42 116.2,46.83 115.09,46.83 135.25,27.78 123.03,30.48 123.98,25.88 128.59,40.01 119.86,41.27 145.1,29.69 143.99,29.69 139.7,33.5 138.59,33.5 137.48,33.5 136.37,33.5 135.73,44.93 136.53,45.72 134.78,45.72 44.45,33.66 40.64,33.66 42.55,36.04
  pour Top (isolate 0.813): 150,76 150,4 arc-90 146,0 4,0 arc-90 0,4 0,76 arc-90 4,80 146,80 arc-90
  pour Bottom (isolate 0.813): 150,76 150,4 arc-90 146,0 4,0 arc-90 0,4 0,76 arc-90 4,80 146,80 arc-90
IO0  (via drill 0.35)
  Top 0.61: v130.41,52.94 143.03,52.94 146.84,49.13 146.84,37.07 132.24,22.46 v129.7,22.46 | v125.81,26.35 124.54,27.62 124.54,34.21 v125.33,35
  Top 0.813: v130.41,52.94 98.9,52.94 v96.28,50.32
  Bottom 0.61: v129.7,22.46 v125.81,26.35 | v125.33,35 126.64,36.31 Q4.2
  Bottom 0.813: IC10.25 v130.42,52.95 v130.41,52.94 | v96.28,50.32 C21.1
  Bottom 1.016: S3.A1 S3.B1 96.28,46.98 C21.1
N$1  (via drill 0.2 pad 0.4)
  Top 1.27: v124.78,58.42 v124.78,62.23
  Bottom 1.27: v124.78,58.42 R4.2 R3.1 v124.78,58.42 | v124.78,58.42 | v124.78,62.23 126.52,63.98 C28.1
N$2
  Bottom 0.305: IC6.3 IC6.4 26.26,27.91 L3.2
N$4
  Bottom 0.305: IC6.11 30.8,22.69 32.78,20.72 34.53,20.72 35.08,21.27 35.08,21.88 EN1.1
  Bottom 0.508: IC7.1 35.24,22.1 EN1.1
N$5
  Bottom 0.61: Q2.4 73.1,22.7 R26.2
  Bottom 1.27: R5.2 R26.2
N$7
  Bottom 0.787: Q4.1 R13.2
N$8
  Bottom 0.787: Q3.1 R6.2
N$9  (via drill 0.2 pad 0.4, 0.35)
  Top 0.61: v112.71,48.9 112.71,45.24 v112.55,45.09
  Bottom 0.152: 114.14,48.1 IC2.5 | 114.14,48.26 IC2.6 IC2.7
  Bottom 0.191: IC2.7 114.05,48.74 113.43,48.74 | IC2.6 113.66,48.42 113.35,48.74 113.43,48.74 | IC2.5 113.43,48.74 | 114.14,48.26 114.14,48.1 | IC2.5 IC2.7 | IC2.5 113.26,48.02 112.39,48.9 C3.1 110.17,49.37 113.59,49.37 IC2.7 | IC2.1 113.89,46.42 v112.55,45.09 R10.1 114.46,42.23 117.95,45.72 117.95,46.67 117.8,46.83 IC2.13
  Bottom 1.27: C3.1 v112.71,48.9 113.19,48.9 113.35,48.74 113.51,48.58
N$10
  Bottom 0.191: IC2.3 110.25,47.23 C4.1
N$11  (via drill 0.35)
  Top 1.27: v114.14,43.02 114.14,27.46 | 114.14,27.46 v119.86,21.75 | v91.76,21.75 93.98,23.97 110.65,23.97 114.14,27.46
  Bottom 0.191: IC2.14 117.16,46.41 117.16,46.04 v114.14,43.02
  Bottom 1.27: R11.2 v119.86,21.75 | R9.2 v91.76,21.75
N$12  (via drill 0.35)
  Top 0.61: v119.38,48.74 119.38,49.21 118.75,49.85 111.92,49.85 109.86,47.78 109.86,44.68 88.1,22.92 TH2.2
  Bottom 0.191: IC2.10 118.67,48.02 v119.38,48.74
  Bottom 1.27: R9.1 86.33,21.75 TH2.2
N$13  (via drill 0.35)
  Top 0.61: v118.27,48.74 118.27,29.34 124.69,22.92 TH3.2
  Bottom 0.191: IC2.9 117.96,48.42 v118.27,48.74
  Bottom 1.27: R11.1 124.62,21.75 TH3.2
N$15
  Bottom 0.406: IC12.19 135.77,20.76 | R25.2 135.77,20.76 | 135.73,20.72 134.94,19.93 134.94,19.53 | 135.77,20.76 135.73,20.72 | 135.73,20.72 135.73,19.53
  Bottom 1.27: R19.1 134.94,19.53 135.73,19.53 R25.2
N$16
  Bottom 0.406: IC12.17 137.07,21.81 C24.1
N$18
  Bottom 0.406: IC4.10 35.55,41.59 41.48,47.51 L2.2
  Bottom 1.27: R14.1 39.41,49.85 L2.2
N$19
  Bottom 0.406: IC4.8 31.77,42.88 32.07,43.18 32.07,43.97 31.11,44.93 31.11,48.74 30.16,49.69 R16.1
N$20
  Bottom 1.27: R16.2 25.15,49.69 TH1.2
N$21
  Bottom 0.406: IC4.12 32.9,40.28 C6.2
  Bottom 0.61: D4.1 37.35,33.66 D5.1
  Bottom 1.27: C6.2 35.09,34.12 D5.1
  Bottom 2.032: D5.1 38.73,30.48 44.45,30.48 47.62,33.66 47.62,47.58 L2.1
N$22
  Bottom 0.406: IC4.7 30.79,43.98 R21.1
N$23  (via drill 0.35)
  Top 1.27: v25.4,44.77 31.91,44.77 v32.38,45.24
  Bottom 1.27: R20.1 R21.2 27.15,44.77 v25.4,44.77 | R18.2 v32.38,45.24
N$24
  Bottom 0.406: IC4.11 34.63,40.94 36.99,38.58 C6.1
N$25
  Bottom 0.406: C8.1 22.22,43.18 22.86,43.18 24.45,41.59 IC4.3 | 24.45,40.28 23.5,40.28 | 23.5,40.28 22.58,40.28 R22.1 23.5,39.36 | IC4.1 24.45,40.28 | 23.5,39.36 23.5,34.45 D6.1 | 23.5,39.36 23.52,39.36 24.45,40.28 | 23.5,39.36 23.5,40.28
  Bottom 0.61: IC5.4 30.33,30.8 24.77,30.8 22.71,32.85 D6.1
  Bottom 1.27: R22.1 C8.1 22.06,41.44
N$26  (via drill 0.2 pad 0.4, 0.35)
  Top 0.406: v24.45,33.66 23.5,34.61 23.5,38.42 | v23.65,41.12 23.5,40.96 | 23.5,40.96 23.5,39.69 | 23.5,39.69 23.5,38.42 | v21.11,39.69 22.23,39.69 | 23.5,40.96 22.23,39.69 | 22.23,39.69 23.5,38.42 | 22.23,39.69 23.5,39.69
  Bottom 0.305: v21.11,39.69 20.16,40.64 R22.2 | v21.11,39.69 20.16,38.74 R23.1 | v21.11,39.69 20.16,39.69
  Bottom 0.406: IC4.2 23.99,40.94 23.81,41.12 v23.65,41.12 | IC5.6 25.08,33.02 v24.45,33.66
  Bottom 0.61: IC5.6 26.83,33.02 27.15,33.34 27.15,37.62 R24.1
  Bottom 1.27: R22.2 20.16,39.69 R23.1
N$27
  Bottom 0.61: IC5.1 31.29,36.34 R24.2
N$28
  Bottom 0.508: Z2.1 45.2,39.33 D4.2
PACK  (via drill 0.35)
  Top 0.406: 13.65,57.31 13.65,55.48 12.98,54.81 | 12.98,54.81 12.7,54.53 | v72.39,53.66 v74.3,53.66 v76.2,53.66 v78.11,53.66 v80.01,53.66 v81.92,53.66 | v78.11,55.88 78.11,55.96 | v78.11,46.99 77.31,47.78 77.31,49.53 77.63,49.21 v80.01,49.21 v81.92,49.21 | 12.14,49.53 12.98,50.36 12.98,54.81 | 81.28,48.26 81.44,48.1 v81.92,48.1 v81.92,46.99 | R2.1 83.73,48.1 82.71,48.1 | R2.1 81.45,49.54 v80.01,48.1
  Top 1.27: v102.87,42.23 98.9,42.23 | v85.17,55.96 98.5,42.62 | 98.5,42.62 98.9,42.23 | 98.9,42.23 88.9,42.23 85.09,46.04 | 98.5,42.62 97.39,42.62 95.89,44.13 94.93,44.13
  Top 2.54: v78.11,49.21 84.85,55.96 | 84.85,55.96 v85.17,55.96 | v78.11,48.1 76.99,46.99 v76.2,46.99 | v85.17,55.96 R2.1 | 78.11,55.96 84.85,55.96 | v85.17,55.96 81.6,59.53 28.1,59.53 | 12.14,59.53 28.1,59.53 | 28.1,59.53 29.05,58.58 | 29.05,58.58 34.05,53.58 | 29.05,58.58 31.35,58.58 | 31.35,58.58 32.15,57.78 | 38.3,53.78 36.67,55.4 26.99,55.4 | 26.99,55.4 24.21,55.4 | 24.21,55.4 22.78,53.98 | 22.78,53.98 20.95,52.15 20.95,49.37 | 18.93,43.62 20.95,45.64 20.95,49.37 | 18.93,43.62 17.03,41.71 | 17.03,41.71 14.61,39.29 | 14.61,39.29 12.14,36.83 | 31.35,58.58 30.08,57.31 13.65,57.31 12.94,57.31 12.78,57.47 | 12.14,59.53 12.14,49.53 | 12.14,49.53 12.14,41.04 | 12.14,41.04 12.14,36.83 | 24.21,55.4 16.75,55.4 | 16.75,55.4 13.26,55.4 13.18,55.32 | 14.61,39.29 14.61,54.45 | 17.03,41.71 17.03,55.13 16.75,55.4 | 18.93,43.62 18.93,54.41 19.05,54.53 | 22.78,53.98 20.56,53.98 19.84,53.26 | 20.95,49.37 26.99,55.4 | U$2.P$5 12.14,59.53 | U$3.P$2 11.47,36.16 12.14,36.83 | U$3.P$4 13.06,41.16 13.1,41.2 12.3,41.2 12.14,41.04 | U$2.P$3 12.7,54.53 12.86,54.37 | U$2.P$1 12.14,49.53 | 12.14,49.53 12.7,49.53 12.78,49.61
  Top 5.08: 93.34,44.77 89.92,44.77 R2.1 88.27,49.53 93.66,44.13 93.98,44.13
  Top 8.89: R1.1 77.31,49.53 R2.1 | R1.1 71.27,55.96 | 78.11,55.96 71.27,55.96 | 71.27,55.96 36.12,55.96 | 36.12,55.96 35.88,56.2 | R1.1 42.55,49.53 38.3,53.78 36.12,55.96
  Bottom 0.305: IC6.8 | IC6.8 29.23,25.24 | IC6.8 29.23,27.58 L3.1 | 29.91,25.3 29.62,25.02 IC6.8
  Bottom 0.406: v76.2,49.21 v76.2,48.1 v78.11,48.1 v78.11,49.21 v76.2,49.21 | v76.2,49.21 v74.3,49.21 v74.3,48.1 v74.3,46.99 | v72.39,49.21 v72.39,48.1 v72.39,46.99 | v70.48,49.21 v70.48,48.1 v70.48,46.99 | v68.58,49.21 v68.58,48.1 v68.58,46.99 | v68.58,55.88 v70.48,55.88 70.56,55.96 72.07,55.96 | v72.39,55.88 v74.3,55.88 74.37,55.96 76.2,55.96 | v76.2,55.88 76.28,55.96 78.11,55.96 | v78.11,55.88 v80.01,55.88 v81.92,55.88 v81.92,53.66 | 81.28,48.26 81.44,48.1 v81.92,48.1 | v72.39,53.66 v70.48,53.66 v68.58,53.66 | v80.01,48.1 v80.01,46.99
  Bottom 0.508: 34.23,27.62 39.05,27.62 | 34.29,26.04 38.73,26.04 | 35.72,26.77 34.99,26.04 30.77,26.04 | 30.77,26.04 30.46,26.34 | 30.46,26.34 29.91,26.89 | L3.1 29.91,27.3 | 30.77,26.04 30.77,26.14 31.4,26.77 30.89,26.77 30.46,26.34
  Bottom 0.813: C5.1 101.54,56.13 IC3.3 97.27,54.09 F2.2 | IC7.3 34.29,26.04 34.29,23.58 33.53,22.82 EN1.2
  Bottom 1.016: 29.91,27.3 29.91,26.89 | 32.89,28.96 34.23,27.62
  Bottom 1.27: R10.2 v102.87,42.23 | 30.7,29.05 L3.1 | IC7.3 31.4,26.77 L3.1 | IC7.3 32.89,28.17 32.89,28.96 C11.1 | L3.1 31.59,28.26 32.38,27.46 | 38.42,26.77 35.72,26.77 IC7.3 | L3.1 29.91,25.3 29.84,25.24
  Bottom 1.575: C11.1 30.7,29.05
  Bottom 1.778: R1.1 62.62,47.31 62.3,46.99 | R1.1 77.79,49.53 | 77.79,49.53 v78.11,49.21 | v76.2,48.1 v74.3,48.1 v72.39,48.1 v70.48,48.1 v68.58,48.1 65.56,48.1 65.09,48.58 | R1.1 61.75,49.53 | 50.16,37.94 50.16,31.43 | 61.75,49.53 50.16,37.94 | 61.75,49.53 62.23,49.05 62.23,48.26 | 83.82,49.53 R2.1 80.72,45.09 78.11,45.09 | 83.82,49.53 81.28,49.53 | 81.28,49.53 80.01,49.53 | 80.01,49.53 77.79,49.53 | 83.82,49.53 80.01,45.72 | 81.28,49.53 81.28,48.26 | 78.11,45.09 v80.01,46.99 81.28,48.26 | 80.01,49.53 78.74,48.26 | 77.47,46.99 77.47,45.09 | 81.28,48.26 78.74,48.26 | 78.74,48.26 77.47,46.99 | 77.47,45.09 78.11,45.09 | 77.47,46.99 78.74,46.99 | 63.18,45.09 64.14,45.09 | 77.47,45.09 64.14,45.09 | 64.14,45.09 63.5,45.72 64.77,46.99 66.04,45.72 76.2,45.72 | R1.1 59.69,49.53 | 50.16,40.01 50.16,37.94 | 50.16,40.01 59.69,49.53 | 59.69,49.53 57.15,49.53 | 50.16,42.55 50.16,40.01 | 50.16,42.55 57.15,49.53 | 57.15,49.53 55.88,49.53 | 50.16,42.55 50.16,43.81 50.8,44.45 | 55.88,49.53 51.44,45.09 | 51.44,45.09 50.8,44.45 | 55.88,49.53 53.34,49.53 50.8,46.99 50.8,45.72 | 51.44,45.09 50.8,45.72 | 50.8,45.72 50.8,44.45
  Bottom 2.54: v78.11,49.21 78.11,48.42 76.68,46.99 v76.2,46.99 v74.3,46.99 v72.39,46.99 v70.48,46.99 v68.58,46.99 62.3,46.99 | 62.62,47.31 62.55,47.31 60.33,45.09 | 60.33,45.09 63.18,45.09 61.44,43.34 | 48.04,26.77 52.39,31.11 | 52.39,37.15 60.33,45.09 | 52.39,31.11 52.39,31.04 61.44,40.08 61.44,43.34 | 52.39,31.11 52.39,33.66 | 52.39,37.15 52.39,34.29 | 52.39,34.29 61.44,43.34 | 52.39,34.29 52.39,33.66 | 52.39,33.66 50.8,32.07 | 50.8,32.07 50.16,31.43 46.04,27.3 | 50.8,32.07 50.8,35.56 52.39,37.15 | v85.17,55.96 F2.2 65.13,54.09 64.93,54.29 66.6,55.96 72.07,55.96 76.2,55.96 78.11,55.96 v85.17,55.96
  Bottom 3.556: 52.17,26.77 48.04,26.77 38.42,26.77 41.69,23.5 48.9,23.5 52.17,26.77 | 58.74,38.1 58.74,33.34 52.17,26.77
PWM  (via drill 0.35)
  Top 0.813: v85.09,19.53 124.62,19.53 127.48,22.38 127.48,29.05 133.11,34.69 v133.11,37.54
  Bottom 0.813: IC10.13 v133.1,37.54 v133.11,37.54 | v85.09,19.53 R5.1
RL
  Bottom 2.54: Q2.7 Q2.6 Q2.5 70.31,32.54 | Q2.7 Q2.8 85.16,38 | 85.16,38 85.16,41.34 | 70.31,32.54 70.31,36.44 R1.2 68.26,41.91 72.71,37.47 72.71,33.34 73.98,32.07 75.88,32.07 85.16,41.34 | 85.16,41.34 R2.2 | R2.2 67.94,41.91 | R2.2 82.94,39.69 71.75,39.69 | R2.2 80.72,37.47 73.66,37.47 | R2.2 78.17,34.92 73.66,34.92 | R2.2 76.27,33.02 74.61,33.02 | Q2.7 80.01,29.84 | 85.16,38 85.16,34.99 80.01,29.84 | 80.01,29.84 76.52,26.35 74.34,26.35 70.31,30.38 70.31,32.54
S  (via drill 0.35)
  Top 0.191: v130.18,55.24 131.13,54.29 144.15,54.29 v147.16,51.28
  Bottom 0.191: IC8.8 119.71,55.24 v130.18,55.24 | v147.16,51.28 147.16,50.64 143.67,47.15 132.56,47.15 131.76,46.35 IC10.21
SCL  (via drill 0.35)
  Top 0.191: v132.72,48.74 v128.59,48.74 | v125.41,46.91 124.7,47.62 v122.4,47.62
  Bottom 0.191: IC10.36 145.8,52.14 142.4,48.74 v132.72,48.74 | v128.59,48.74 126.76,46.91 v125.41,46.91 | v122.4,47.62 IC2.11
SDA  (via drill 0.35)
  Top 0.191: v132.72,49.85 v128.59,49.85 | v124.3,46.91 124.22,46.83 v121.6,46.83
  Bottom 0.191: IC10.33 141.99,52.3 139.54,49.85 v132.72,49.85 | v128.59,49.85 127.24,49.85 v124.3,46.91 | v121.6,46.83 121.21,47.23 IC2.12
SHDN  (via drill 0.35)
  Top 0.191: v129.38,54.45 130.02,53.82 143.51,53.82 v146.05,51.28
  Bottom 0.191: IC8.5 118.11,60.33 117.32,59.53 117.32,56.04 118.9,54.45 v129.38,54.45 | v146.05,51.28 146.05,50.16 143.51,47.62 IC10.22
SOL
  Bottom 2.032: D6.2 14.72,33.66 U$4.P$4
V+  (via drill 0.2 pad 0.4)
  Top 0.381: v143.93,26.65 140.84,26.65 139.91,25.72 v139.91,25.08 v139.91,23.34
  Bottom 0.381: v139.91,25.08 IC9.5 | J1.1 144.73,26.65 v143.93,26.65 | v139.91,23.34 139.91,22.86 141.02,21.75 C2.1